# EAGLE design display (EAGLE 7.5.0)

## Sheet 1 of 5
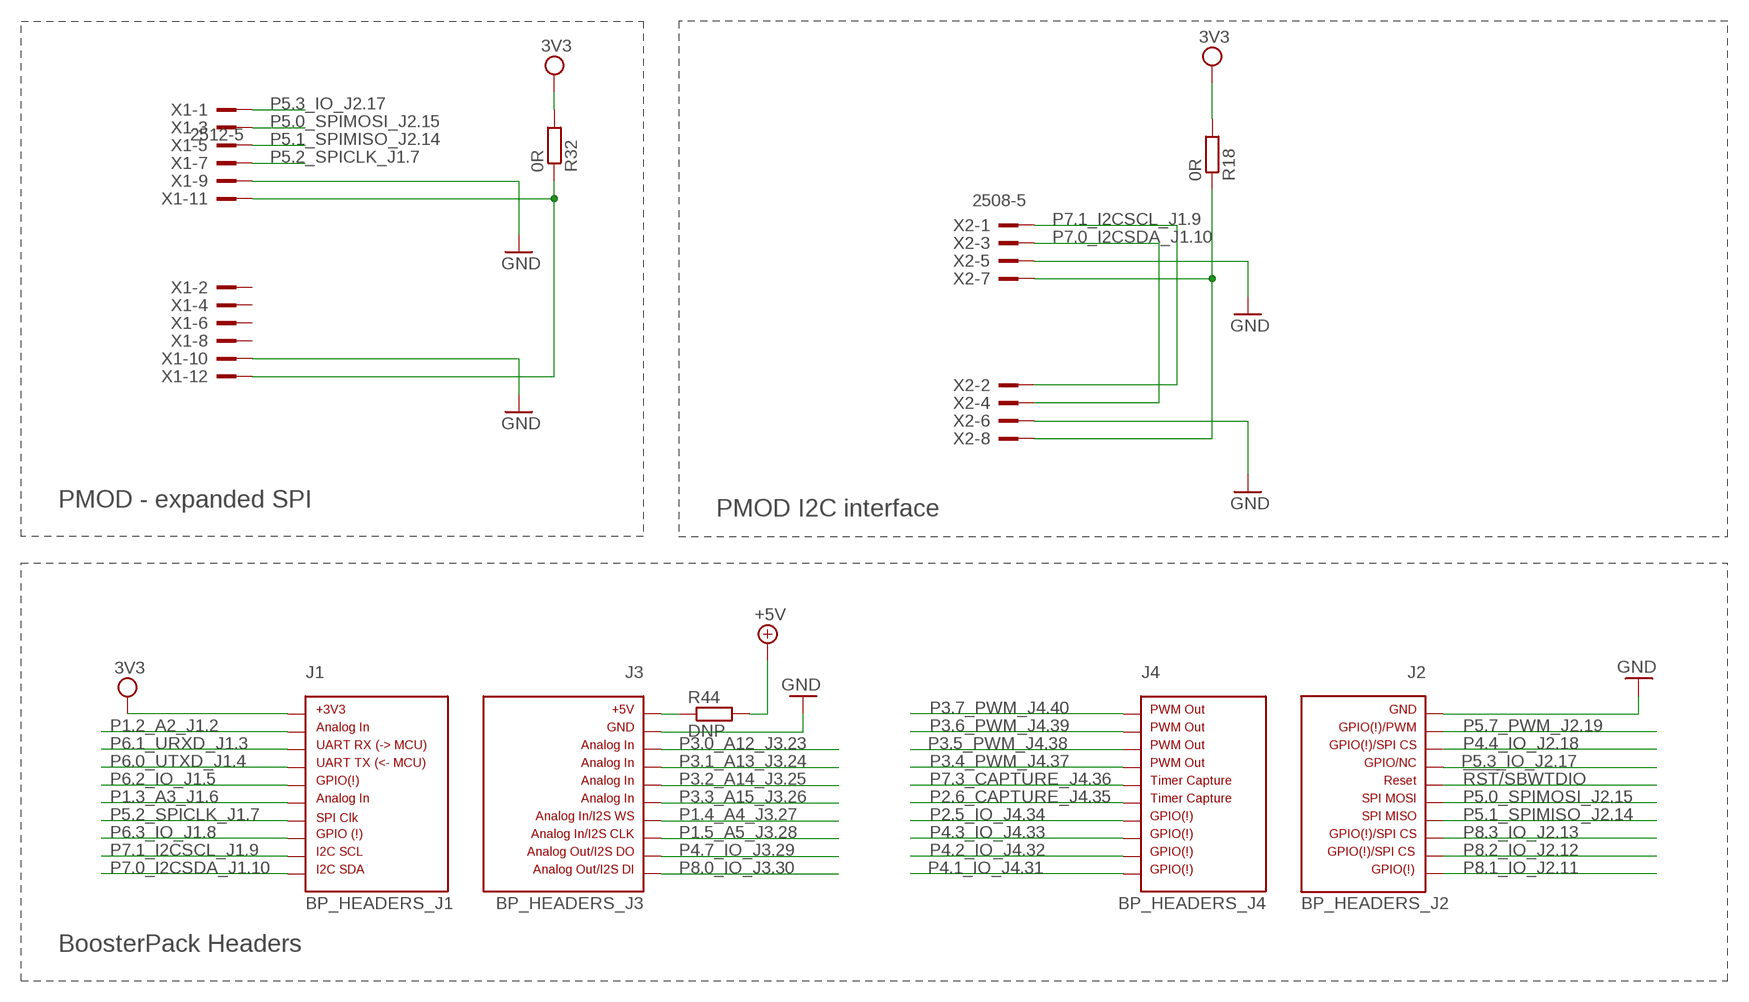
[diagram p0: schematic, sheet 1]

### Parts
J1  BP_HEADERS_J1  [J1]
J2  BP_HEADERS_J2  [J2]
J3  BP_HEADERS_J3  [J3]
J4  BP_HEADERS_J4  [J4]
R18  0R  R-EU_0204/2V  [0204V]
R32  0R  R-EU_0204/2V  [0204V]
R44  DNP  R-EU_R0805W  [R0805W]
X1  2512-5  [PAK100/2500-5-12]
X2  2508-5  [PAK100/2500-5-08]

### Nets
3V3: J1.1 R18.2 R32.2 ; also sheet 2,3,4,5
!RST!/SBWTDIO: J2.16
+5V: R44.2 ; also sheet 2,4
GND: J2.20 J3.22 X1.9 X1.10 X2.5 X2.6 ; also sheet 2,3,4,5
N$25: R18.1 X2.7 X2.8
N$38: R32.1 X1.11 X1.12
N$41: J3.21 R44.1
P1.2_A2_J1.2: J1.2 ; also sheet 2
P1.3_A3_J1.6: J1.6 ; also sheet 2
P1.4_A4_J3.27: J3.27 ; also sheet 3
P1.5_A5_J3.28: J3.28 ; also sheet 3
P2.5_IO_J4.34: J4.34 ; also sheet 3
P2.6_CAPTURE_J4.35: J4.35 ; also sheet 3
P3.0_A12_J3.23: J3.23 ; also sheet 2
P3.1_A13_J3.24: J3.24 ; also sheet 2
P3.2_A14_J3.25: J3.25 ; also sheet 2
P3.3_A15_J3.26: J3.26 ; also sheet 3
P3.4_PWM_J4.37: J4.37
P3.5_PWM_J4.38: J4.38
P3.6_PWM_J4.39: J4.39
P3.7_PWM_J4.40: J4.40
P4.1_IO_J4.31: J4.31
P4.2_IO_J4.32: J4.32
P4.3_IO_J4.33: J4.33
P4.4_IO_J2.18: J2.18 ; also sheet 4
P4.7_IO_J3.29: J3.29
P5.0_SPIMOSI_J2.15: J2.15 X1.3 ; also sheet 3,4
P5.1_SPIMISO_J2.14: J2.14 X1.5 ; also sheet 3
P5.2_SPICLK_J1.7: J1.7 X1.7 ; also sheet 3,4
P5.3_IO_J2.17: J2.17 X1.1
P5.7_PWM_J2.19: J2.19 ; also sheet 5
P6.0_UTXD_J1.4: J1.4
P6.1_URXD_J1.3: J1.3
P6.2_IO_J1.5: J1.5
P6.3_IO_J1.8: J1.8 ; also sheet 5
P7.0_I2CSDA_J1.10: J1.10 X2.3 X2.4 ; also sheet 3,4
P7.1_I2CSCL_J1.9: J1.9 X2.1 X2.2 ; also sheet 3,4
P7.3_CAPTURE_J4.36: J4.36 ; also sheet 4
P8.0_IO_J3.30: J3.30
P8.1_IO_J2.11: J2.11 ; also sheet 5
P8.2_IO_J2.12: J2.12 ; also sheet 5
P8.3_IO_J2.13: J2.13 ; also sheet 4
Unconnected: X1.2 X1.4 X1.6 X1.8

### Notes on the sheet
- PMOD - expanded SPI
- PMOD I2C interface
- BoosterPack Headers

## Sheet 2 of 5
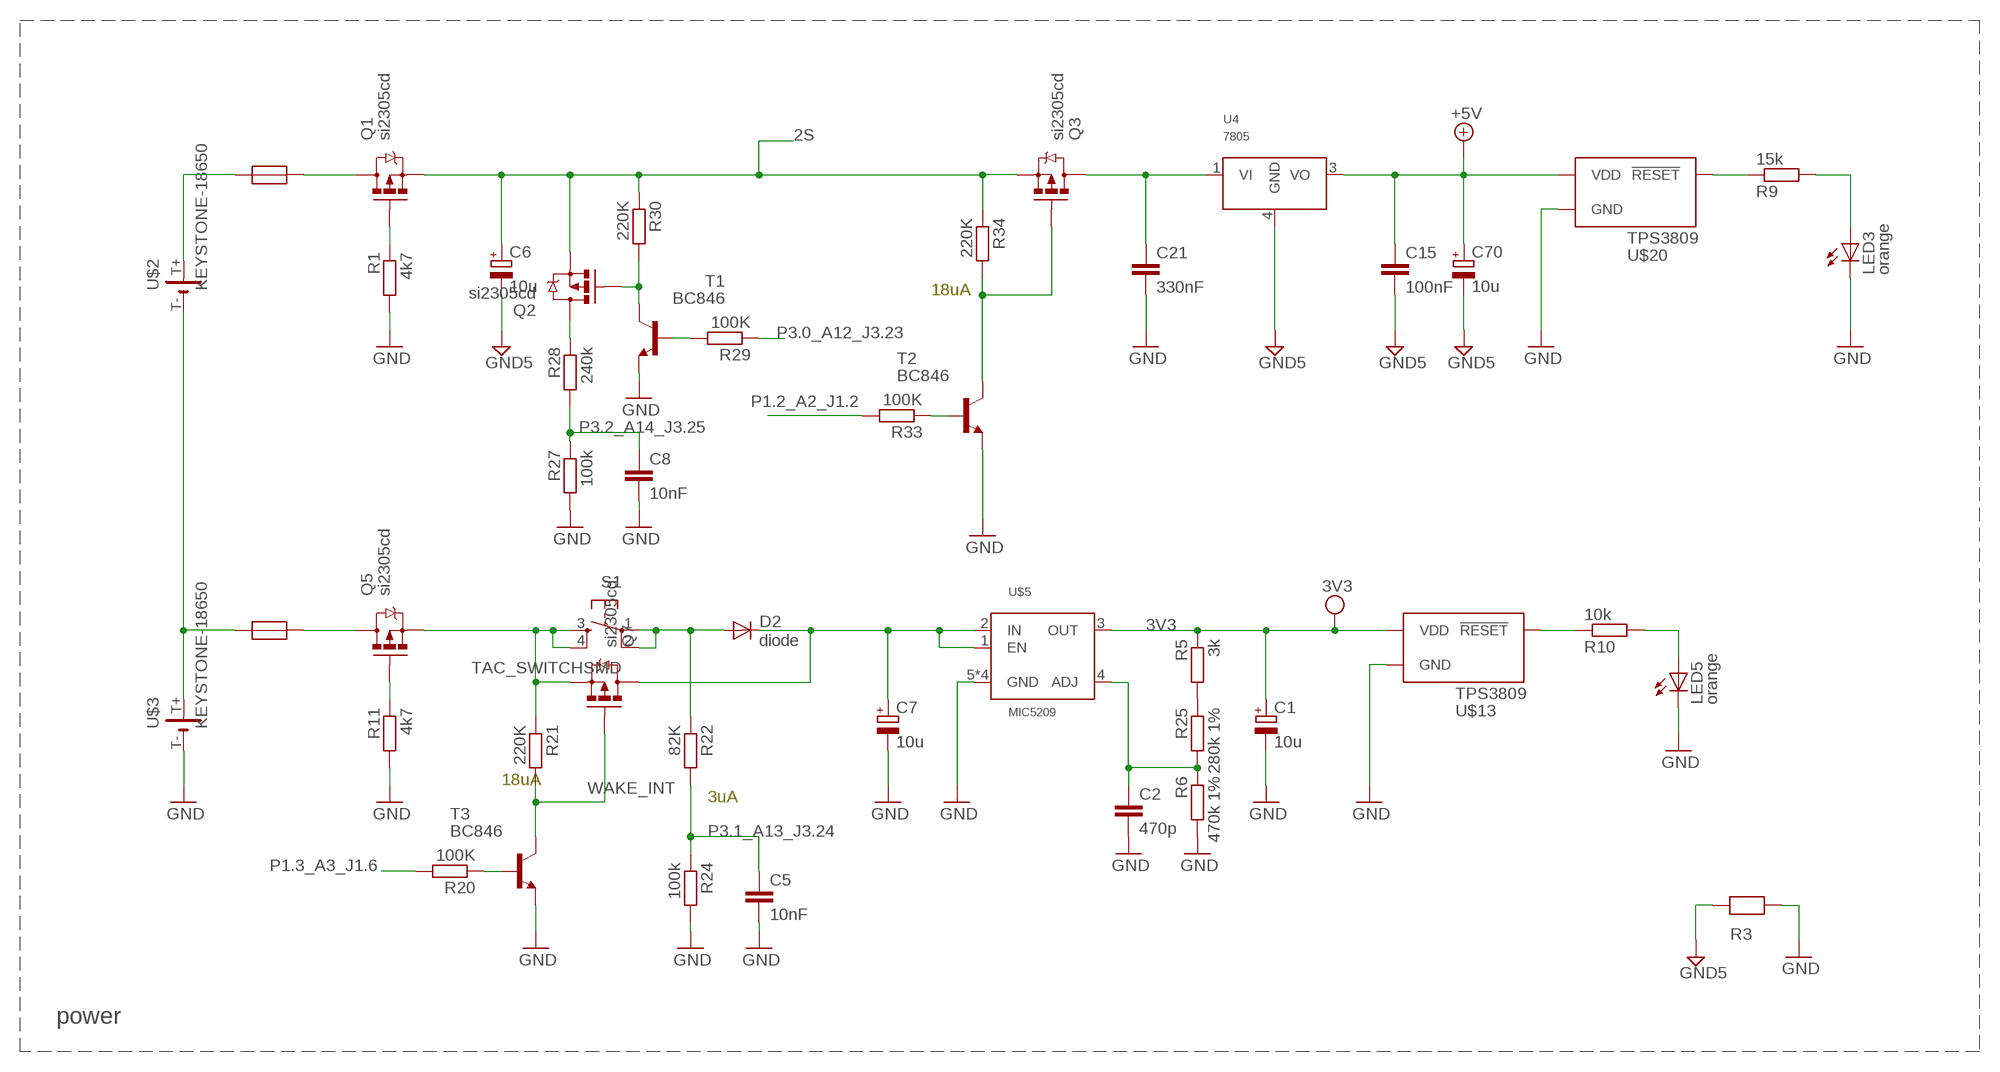
[diagram p1: schematic, sheet 2]

### Parts
C1  10u  CPOL-EU153CLV-0405  [153CLV-0405]
C2  470p  C-EUC0805  [C0805]
C5  10nF  C-EUC0805  [C0805]
C6  10u  CPOL-EU153CLV-0405  [153CLV-0405]
C7  10u  CPOL-EU153CLV-0405  [153CLV-0405]
C8  10nF  C-EUC0805  [C0805]
C15  100nF  C-EUC0805  [C0805]
C21  330nF  C-EUC0805  [C0805]
C70  10u  CPOL-EU153CLV-0405  [153CLV-0405]
D2  diode  DIODESMA  [SMA-DIODE]
LED3  orange  LEDCHIPLED_0805  [CHIPLED_0805]
LED5  orange  LEDCHIPLED_0805  [CHIPLED_0805]
Q1  si2305cd  MOSFET-PCHANNELSMD_POWER  [SOT23-3_POWER]
Q2  si2305cd  MOSFET-PCHANNELSMD_POWER  [SOT23-3_POWER]
Q3  si2305cd  MOSFET-PCHANNELSMD_POWER  [SOT23-3_POWER]
Q5  si2305cd  MOSFET-PCHANNELSMD_POWER  [SOT23-3_POWER]
Q7  si2305cd  MOSFET-PCHANNELSMD_POWER  [SOT23-3_POWER]
R1  4k7  R-EU_R0805W  [R0805W]
R3  0R_0805  [R0805W]
R5  3k  R-EU_R0805W  [R0805W]
R6  470k 1%  R-EU_R0805W  [R0805W]
R9  15k  R-EU_R0805W  [R0805W]
R10  10k  R-EU_R0805W  [R0805W]
R11  4k7  R-EU_R0805W  [R0805W]
R20  100K  R-EU_R0805W  [R0805W]
R21  220K  R-EU_R0805W  [R0805W]
R22  82K  R-EU_R0805W  [R0805W]
R24  100k  R-EU_R0805W  [R0805W]
R25  280k 1%  R-EU_R0805W  [R0805W]
R27  100k  R-EU_R0805W  [R0805W]
R28  240k  R-EU_R0805W  [R0805W]
R29  100K  R-EU_R0805W  [R0805W]
R30  220K  R-EU_R0805W  [R0805W]
R33  100K  R-EU_R0805W  [R0805W]
R34  220K  R-EU_R0805W  [R0805W]
S1  TAC_SWITCHSMD  [TACTILE-SWITCH-SMD]
T1  BC846  [SOT23]
T2  BC846  [SOT23]
T3  BC846  [SOT23]
U4  7805  78XX  [D2PACK]
U$2  KEYSTONE-18650  [KEYSTONE_COMBO_18650]
U$3  KEYSTONE-18650  [KEYSTONE_COMBO_18650]
U$5  MIC5209  [SO-08]
U$7  Fuse 1A  RESETTABLE_0805  [0805W]
U$8  Fuse 1A  RESETTABLE_0805  [0805W]
U$13  TPS3809  [R_PDSO_G3]
U$20  TPS3809  [R_PDSO_G3]

### Nets
2S: C6.+ Q1.2(S) Q2.2(S) Q3.2(S) R30.1 R34.1 ; also sheet 5
3V3: C1.+ R5.1 U$5.3(OUT) U$13.P$3(VDD) ; also sheet 1,3,4,5
+5V: C15.1 C70.+ U4.3(VO) U$20.P$3(VDD) ; also sheet 1,4
GND: C1.- C2.2 C5.2 C7.- C8.2 C21.2 LED3.C LED5.C R1.2 R3.2 R6.2 R11.2 R24.2 R27.2 T1.2(E) T2.2(E) T3.2(E) U$3.T-(-) U$5.5(GND) U$5.6(GND) U$5.7(GND) U$5.8(GND) U$13.P$1(GND) U$20.P$1(GND) ; also sheet 1,3,4,5
GND5: C6.- C15.2 C70.- R3.1 U4.4(GND) ; also sheet 4
N$1: C21.1 Q3.3(D) U4.1(VI)
N$2: Q1.1(G) R1.1
N$6: Q5.2(S) Q7.2(S) R21.1 S1.3 S1.4
N$7: LED3.A R9.2
N$9: C2.1 R6.1 R25.2 U$5.4(ADJ)
N$10: Q1.3(D) U$7.2
N$11: Q5.3(D) U$8.2
N$13: R9.1 U$20.P$2(!RESET)
N$14: LED5.A R10.2
N$15: R10.1 U$13.P$2(!RESET)
N$23: C7.+ D2.C Q7.3(D) U$5.1(EN) U$5.2(IN)
N$24: Q5.1(G) R11.1
N$26: R5.2 R25.1
N$29: Q2.3(D) R28.1
N$30: Q2.1(G) R30.2 T1.3(C)
N$31: R20.1 T3.1(B)
N$32: R29.2 T1.1(B)
N$35: R33.1 T2.1(B)
N$37: Q3.1(G) R34.2 T2.3(C)
N_BAT1: U$2.T-(-) U$3.T+(+) U$8.1
N_BAT2: U$2.T+(+) U$7.1
P1.2_A2_J1.2: R33.2 ; also sheet 1
P1.3_A3_J1.6: R20.2 ; also sheet 1
P3.0_A12_J3.23: R29.1 ; also sheet 1
P3.1_A13_J3.24: C5.1 R22.2 R24.1 ; also sheet 1
P3.2_A14_J3.25: C8.1 R27.1 R28.2 ; also sheet 1
PUSH: D2.A R22.1 S1.1 S1.2
WAKE_INT: Q7.1(G) R21.2 T3.3(C) ; also sheet 4

### Notes on the sheet
- 18uA
- 18uA
- 3uA
- power

## Sheet 3 of 5
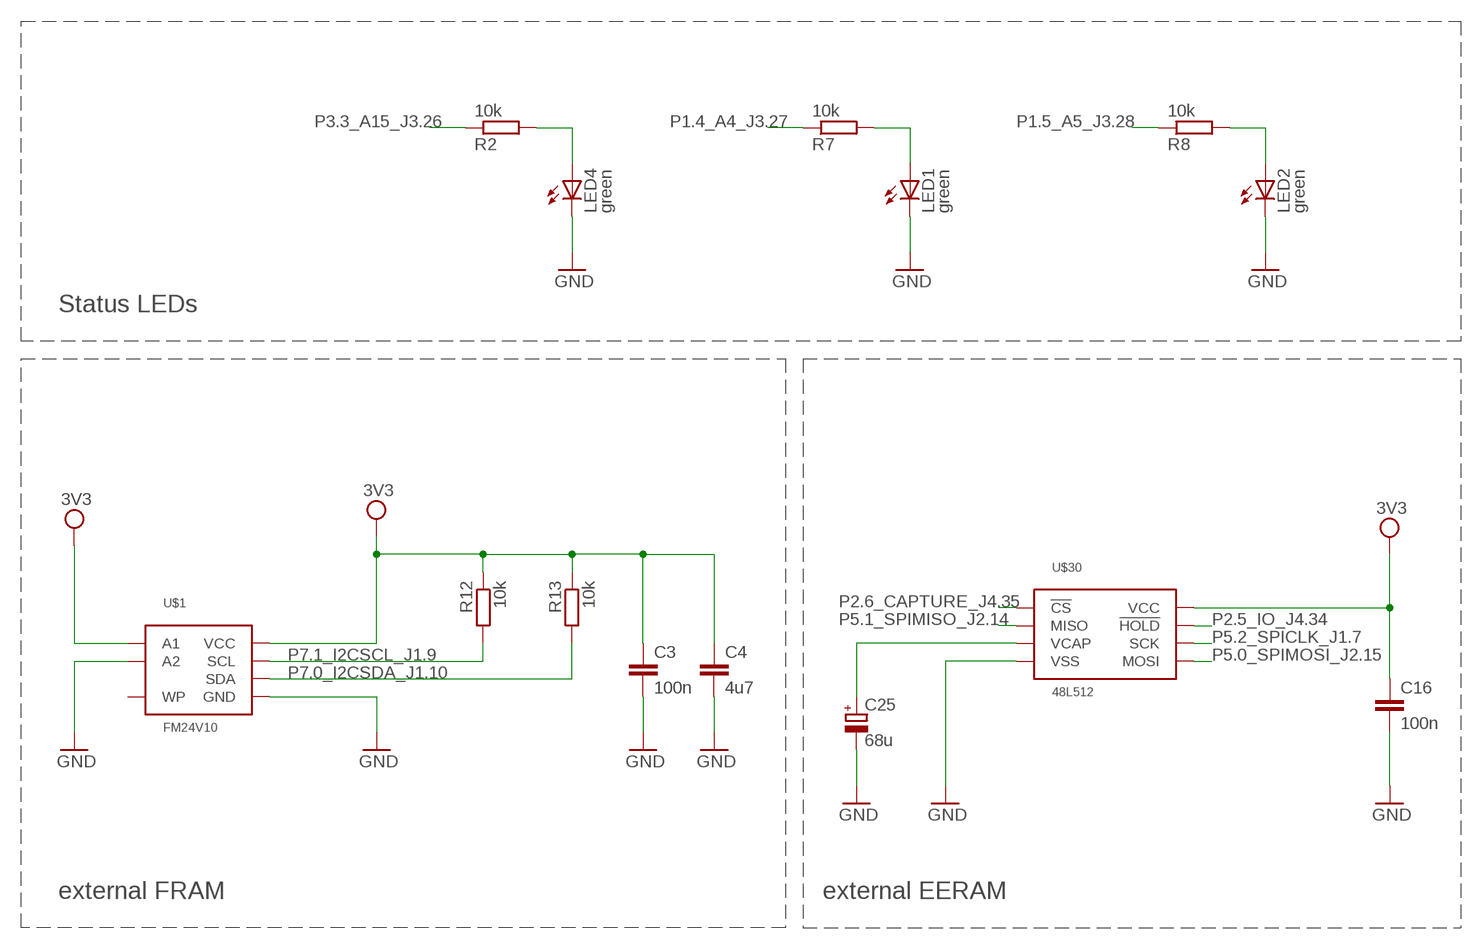
[diagram p2: schematic, sheet 3]

### Parts
C3  100n  C-EUC0805  [C0805]
C4  4u7  C-EUC0805  [C0805]
C16  100n  C-EUC0805  [C0805]
C25  68u  CPOL-EUSANYO_SMD_C6  [SANYO-OSCON_SMD_C6]
LED1  green  LEDCHIPLED_0805  [CHIPLED_0805]
LED2  green  LEDCHIPLED_0805  [CHIPLED_0805]
LED4  green  LEDCHIPLED_0805  [CHIPLED_0805]
R2  10k  R-EU_R0805W  [R0805W]
R7  10k  R-EU_R0805W  [R0805W]
R8  10k  R-EU_R0805W  [R0805W]
R12  10k  R-EU_R0805W  [R0805W]
R13  10k  R-EU_R0805W  [R0805W]
U$1  FM24V10  FM24V  [SO-08]
U$30  48L512  48LXXX  [SO-08]

### Nets
3V3: C3.1 C4.1 C16.1 R12.1 R13.1 U$1.2(A1) U$1.8(VCC) U$30.8(VCC) ; also sheet 1,2,4,5
GND: C3.2 C4.2 C16.2 C25.- LED1.C LED2.C LED4.C U$1.3(A2) U$1.4(GND) U$30.4(VSS) ; also sheet 1,2,4,5
N$5: LED4.A R2.2
N$8: LED1.A R7.2
N$12: LED2.A R8.2
N$40: C25.+ U$30.3(VCAP)
P1.4_A4_J3.27: R7.1 ; also sheet 1
P1.5_A5_J3.28: R8.1 ; also sheet 1
P2.5_IO_J4.34: U$30.7(!HOLD) ; also sheet 1
P2.6_CAPTURE_J4.35: U$30.1(!CS) ; also sheet 1
P3.3_A15_J3.26: R2.1 ; also sheet 1
P5.0_SPIMOSI_J2.15: U$30.5(MOSI) ; also sheet 1,4
P5.1_SPIMISO_J2.14: U$30.2(MISO) ; also sheet 1
P5.2_SPICLK_J1.7: U$30.6(SCK) ; also sheet 1,4
P7.0_I2CSDA_J1.10: R13.2 U$1.5(SDA) ; also sheet 1,4
P7.1_I2CSCL_J1.9: R12.2 U$1.6(SCL) ; also sheet 1,4
Unconnected: U$1.7(WP)

### Notes on the sheet
- Status LEDs
- external FRAM | external EERAM

## Sheet 4 of 5
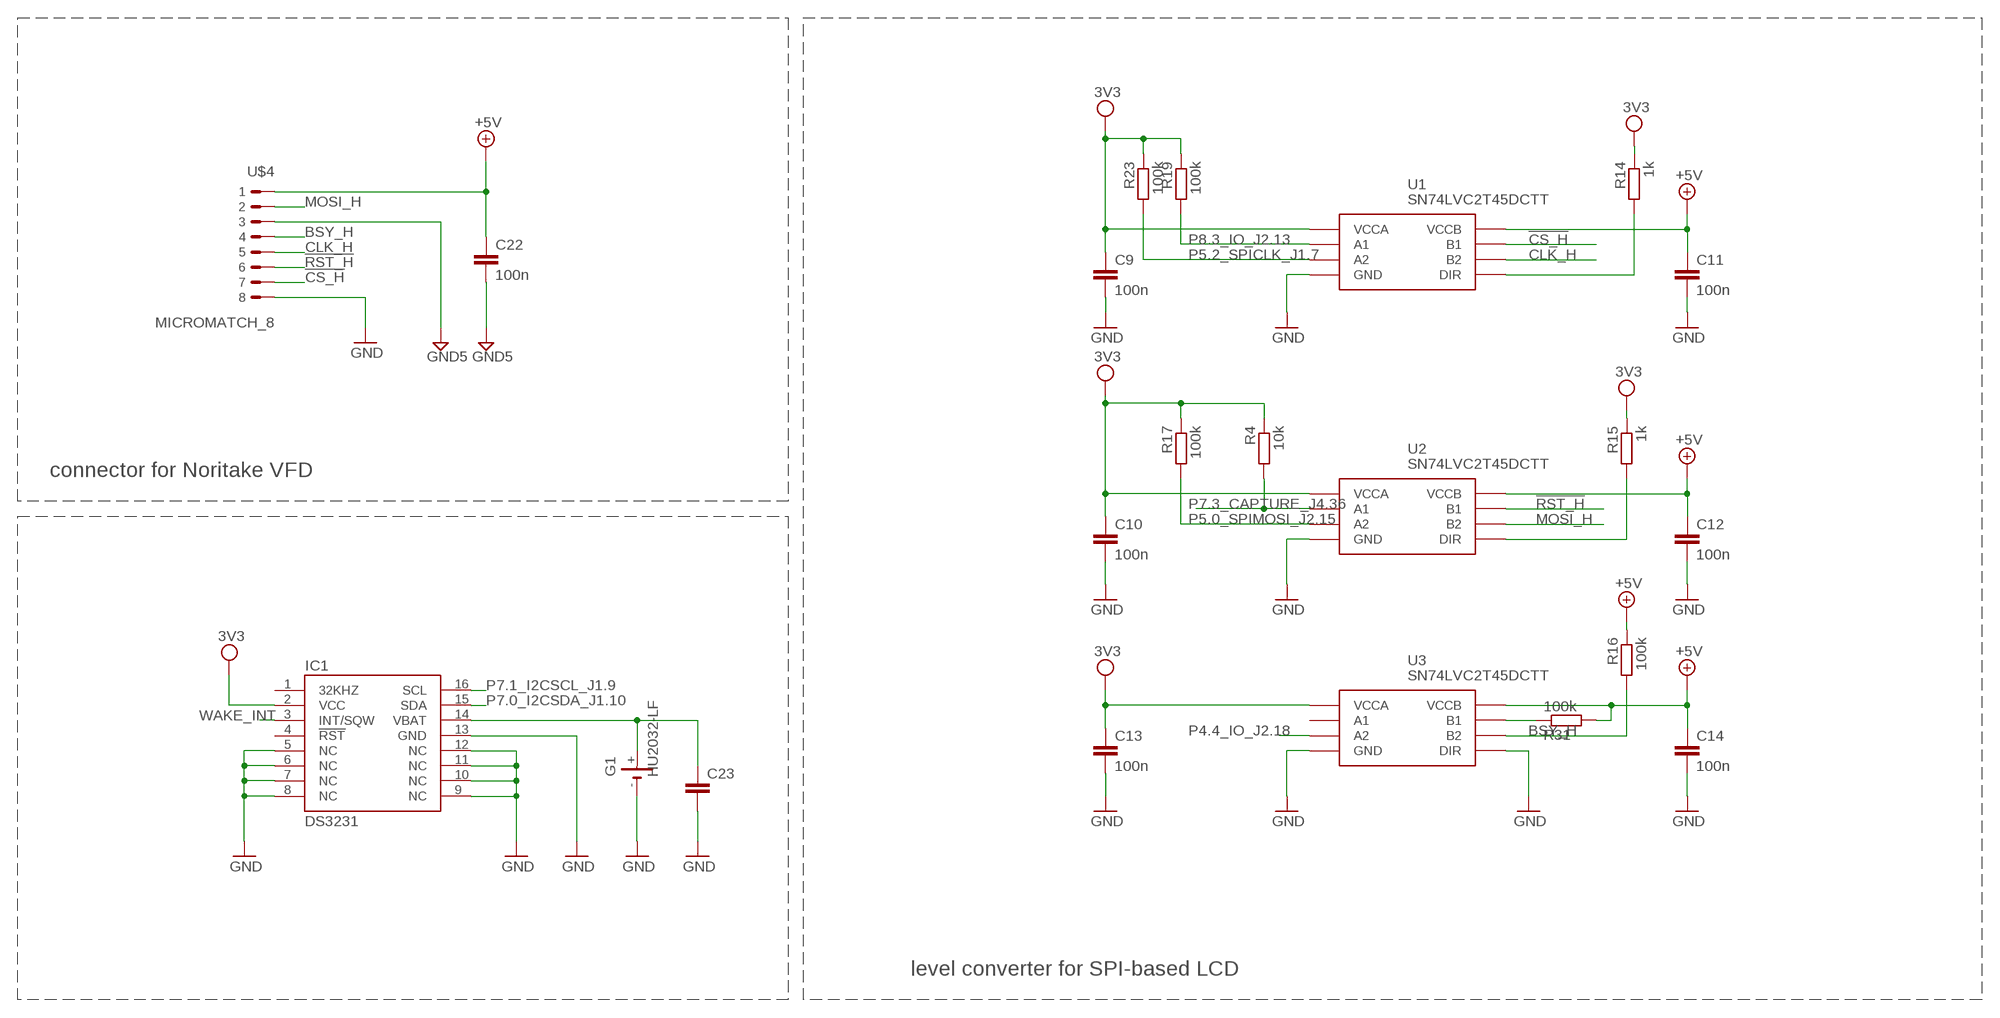
[diagram p3: schematic, sheet 4]

### Parts
C9  100n  C-EUC0805  [C0805]
C10  100n  C-EUC0805  [C0805]
C11  100n  C-EUC0805  [C0805]
C12  100n  C-EUC0805  [C0805]
C13  100n  C-EUC0805  [C0805]
C14  100n  C-EUC0805  [C0805]
C22  100n  C-EUC0805  [C0805]
C23  C-EU102-054X133  [C102-054X133]
G1  HU2032-LF  [HU2032-LF]
IC1  DS3231  [SO-16]
R4  10k  R-EU_R0805W  [R0805W]
R14  1k  R-EU_R0805W  [R0805W]
R15  1k  R-EU_R0805W  [R0805W]
R16  100k  R-EU_R0805W  [R0805W]
R17  100k  R-EU_R0805W  [R0805W]
R19  100k  R-EU_R0805W  [R0805W]
R23  100k  R-EU_R0805W  [R0805W]
R31  100k  R-EU_R0805W  [R0805W]
U1  SN74LVC2T45DCTT  [SSOP8]
U2  SN74LVC2T45DCTT  [SSOP8]
U3  SN74LVC2T45DCTT  [SSOP8]
U$4  MICROMATCH_8  [MICROMATCH8]

### Nets
3V3: C9.1 C10.1 C13.1 IC1.2(VCC) R4.1 R14.1 R15.1 R17.1 R19.1 R23.1 U1.P$1(VCCA) U2.P$1(VCCA) U3.P$1(VCCA) ; also sheet 1,2,3,5
!CS_H: U1.P$7(B1) U$4.P$7
!RST_H: U2.P$7(B1) U$4.P$6
+5V: C11.1 C12.1 C14.1 C22.1 R16.1 R31.2 U1.P$8(VCCB) U2.P$8(VCCB) U3.P$8(VCCB) U$4.P$1 ; also sheet 1,2
BSY_H: R16.2 U3.P$6(B2) U$4.P$4
CLK_H: U1.P$6(B2) U$4.P$5
GND: C9.2 C10.2 C11.2 C12.2 C13.2 C14.2 C23.2 G1.- IC1.5(NC) IC1.6(NC) IC1.7(NC) IC1.8(NC) IC1.9(NC) IC1.10(NC) IC1.11(NC) IC1.12(NC) IC1.13(GND) U1.P$4(GND) U2.P$4(GND) U3.P$4(GND) U3.P$5(DIR) U$4.P$8 ; also sheet 1,2,3,5
GND5: C22.2 U$4.P$3 ; also sheet 2
MOSI_H: U2.P$6(B2) U$4.P$2
N$4: R14.2 U1.P$5(DIR)
N$17: R15.2 U2.P$5(DIR)
N$20: R31.1 U3.P$7(B1)
N$27: C23.1 G1.+ IC1.14(VBAT)
P4.4_IO_J2.18: U3.P$3(A2) ; also sheet 1
P5.0_SPIMOSI_J2.15: R17.2 U2.P$3(A2) ; also sheet 1,3
P5.2_SPICLK_J1.7: R23.2 U1.P$3(A2) ; also sheet 1,3
P7.0_I2CSDA_J1.10: IC1.15(SDA) ; also sheet 1,3
P7.1_I2CSCL_J1.9: IC1.16(SCL) ; also sheet 1,3
P7.3_CAPTURE_J4.36: R4.2 U2.P$2(A1) ; also sheet 1
P8.3_IO_J2.13: R19.2 U1.P$2(A1) ; also sheet 1
WAKE_INT: IC1.3(INT/SQW) ; also sheet 2
Unconnected: G1.+@1(+) IC1.1(32KHZ) IC1.4(!RST) U3.P$2(A1)

### Notes on the sheet
- connector for Noritake VFD
- level converter for SPI-based LCD

## Sheet 5 of 5
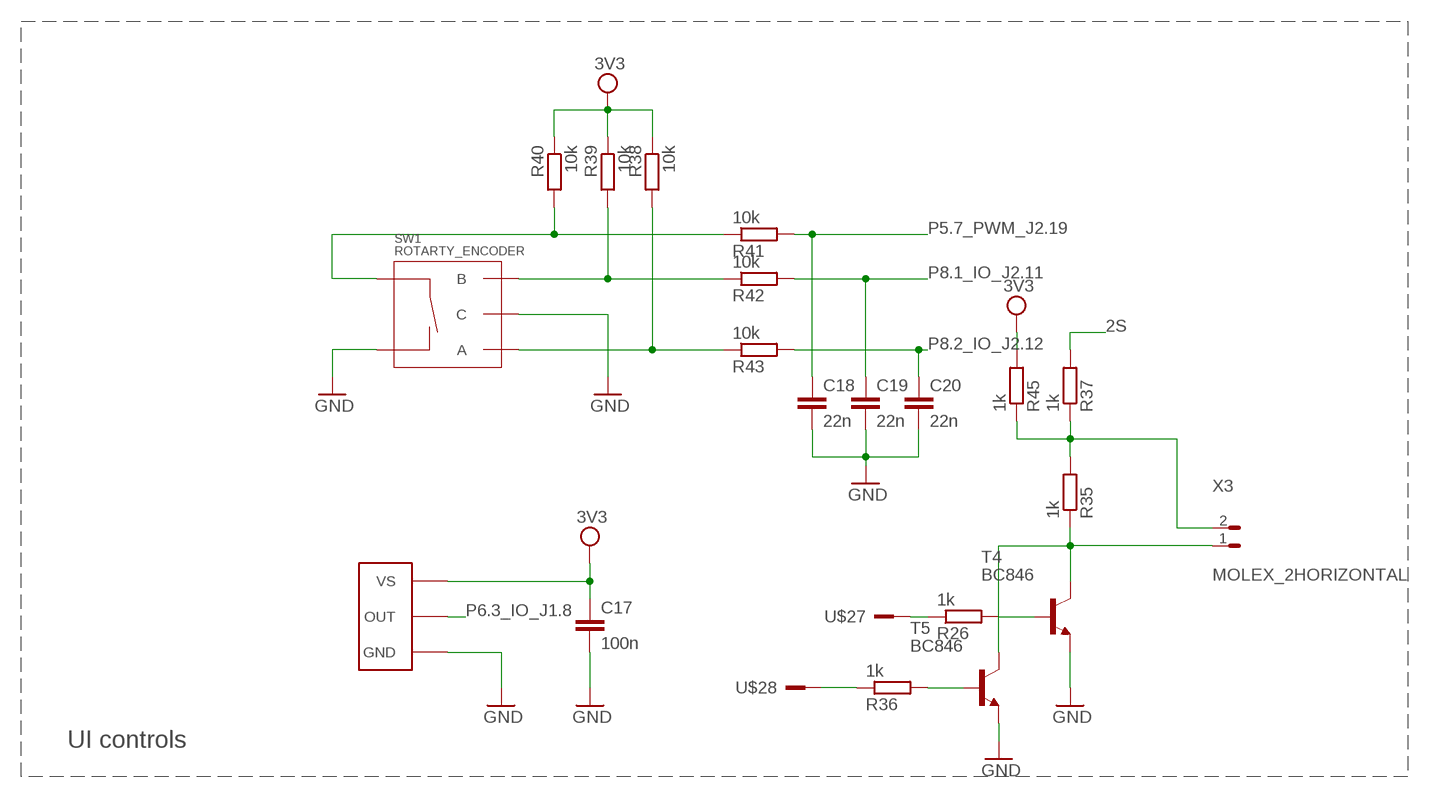
[diagram p4: schematic, sheet 5]

### Parts
C17  100n  C-EUC0805  [C0805]
C18  22n  C-EUC0805  [C0805]
C19  22n  C-EUC0805  [C0805]
C20  22n  C-EUC0805  [C0805]
R26  1k  R-EU_R0805W  [R0805W]
R35  1k  R-EU_R0805W  [R0805W]
R36  1k  R-EU_R0805W  [R0805W]
R37  1k  R-EU_R0805W  [R0805W]
R38  10k  R-EU_R0805W  [R0805W]
R39  10k  R-EU_R0805W  [R0805W]
R40  10k  R-EU_R0805W  [R0805W]
R41  10k  R-EU_R0805W  [R0805W]
R42  10k  R-EU_R0805W  [R0805W]
R43  10k  R-EU_R0805W  [R0805W]
R45  1k  R-EU_R0805W  [R0805W]
SW1  ROTARTY_ENCODER  [ROTARY_ENC_PLAIN]
T4  BC846  [SOT23]
T5  BC846  [SOT23]
U$26  TSOP36X  [TSOP36X_SMD]
U$27  TP  [TP_THT]
U$28  TP  [TP_THT]
X3  MOLEX_2HORIZONTAL  [0530480210]

### Nets
2S: R37.2 ; also sheet 2
3V3: C17.1 R38.1 R39.1 R40.1 R45.2 U$26.P$3(VS) ; also sheet 1,2,3,4
GND: C17.2 C18.2 C19.2 C20.2 SW1.C SW1.SW- T4.2(E) T5.2(E) U$26.P$1(GND) ; also sheet 1,2,3,4
N$3: R35.2 R37.1 R45.1 X3.2
N$16: R26.2 T4.1(B)
N$21: R35.1 T4.3(C) T5.3(C) X3.1
N$22: R26.1 U$27.1(KL)
N$28: R40.2 R41.1 SW1.SW+
N$33: R39.2 R42.1 SW1.B
N$34: R38.2 R43.1 SW1.A
N$36: R36.2 T5.1(B)
N$39: R36.1 U$28.1(KL)
P5.7_PWM_J2.19: C18.1 R41.2 ; also sheet 1
P6.3_IO_J1.8: U$26.P$4(OUT) ; also sheet 1
P8.1_IO_J2.11: C19.1 R42.2 ; also sheet 1
P8.2_IO_J2.12: C20.1 R43.2 ; also sheet 1

### Notes on the sheet
- UI controls

## Library data of the parts
C1 C6 C7 C25 C70 = rcl:CPOL-EU: POLARIZED CAPACITOR, European symbol
C2-C5 C8-C23 = rcl:C-EU: CAPACITOR, European symbol
D2 = SparkFun-DiscreteSemi:DIODE: Diode These are standard reverse protection diodes and small signal diodes. SMA package can handle up to about 1A. SOD-323 can handle about 200mA. What the SOD-323 package when ordering, there are some mfgs out there that are 5-pin packages.
G1 = Simplex-Battery:HU2032-LF: Renata HU2032 Li battery holder
IC1 = Simplex-ICs:DS3231: DS3231 RTC
J1 = LaunchPad_Template_Library:BP_HEADERS_J1
J2 = LaunchPad_Template_Library:BP_HEADERS_J2
J3 = LaunchPad_Template_Library:BP_HEADERS_J3
J4 = LaunchPad_Template_Library:BP_HEADERS_J4
LED1-LED5 = led:LED: LED OSRAM: - CHIPLED LG R971, LG N971, LY N971, LG Q971, LY Q971, LO R971, LY R971 LH N974, LH R974 LS Q976, LO Q976, LY Q976 LO Q996 - Hyper CHIPLED LW Q18S LB Q993, LB Q99A, LB R99A - SideLED LS A670, LO A670, LY A670, LG A670, LP A670 LB A673, LV A673, LT A673, LW A673 LH A674 LY A675 LS A676, LA A676, LO A676, LY A676, LW A676 LS A679, LY A679, LG A679 - Hyper Micro SIDELED® LS Y876, LA Y876, LO Y876, LY Y876 LT Y87S - SmartLED LW L88C, LW L88S LB L89C, LB L89S, LG L890 LS L89K, LO L89K, LY L89K LS L896, LA L896, LO L896, LY L896 - TOPLED LS T670, LO T670, LY T670, LG T670, LP T670 LSG T670, LSP T670, LSY T670, LOP T670, LYG T670 LG T671, LOG T671, LSG T671 LB T673, LV T673, LT T673, LW T673 LH T674 LS T676, LA T676, LO T676, LY T676, LB T676, LH T676, LSB T676, LW T676 LB T67C, LV T67C, LT T67C, LS T67K, LO T67K, LY T67K, LW E67C LS E67B, LA E67B, LO E67B, LY E67B, LB E67C, LV E67C, LT E67C LW T67C LS T679, LY T679, LG T679 LS T770, LO T770, LY T770, LG T770, LP T770 LB T773, LV T773, LT T773, LW T773 LH T774 LS E675, LA E675, LY E675, LS T675 LS T776, LA T776, LO T776, LY T776, LB T776 LHGB T686 LT T68C, LB T68C - Hyper Mini TOPLED® LB M676 - Mini TOPLED Santana® LG M470 LS M47K, LO M47K, LY M47K Source: http://www.osram.convergy.de LUXEON: - LUMILED® LXK2-PW12-R00, LXK2-PW12-S00, LXK2-PW14-U00, LXK2-PW14-V00 LXK2-PM12-R00, LXK2-PM12-S00, LXK2-PM14-U00 LXK2-PE12-Q00, LXK2-PE12-R00, LXK2-PE12-S00, LXK2-PE14-T00, LXK2-PE14-U00 LXK2-PB12-K00, LXK2-PB12-L00, LXK2-PB12-M00, LXK2-PB14-N00, LXK2-PB14-P00, LXK2-PB14-Q00 LXK2-PR12-L00, LXK2-PR12-M00, LXK2-PR14-Q00, LXK2-PR14-R00 LXK2-PD12-Q00, LXK2-PD12-R00, LXK2-PD12-S00 LXK2-PH12-R00, LXK2-PH12-S00 LXK2-PL12-P00, LXK2-PL12-Q00, LXK2-PL12-R00 Source: www.luxeon.com KINGBRIGHT: KA-3528ASYC Source: www.kingbright.com
Q1-Q3 Q5 Q7 = Simplex-DiscreteSemi:MOSFET-PCHANNEL: Generic PMOSFET
R1 R2 R4-R45 = rcl:R-EU_: RESISTOR, European symbol
R3 = Simplex-Jumpers:0R
S1 = SparkFun-Electromechanical:TAC_SWITCH: Momentary Switch Button commonly used for reset or general input. Spark Fun Electronics SKU : COM-00097 SMT- SWCH-08247; PROD_ID: SWCH-08247
SW1 = SparkFun-Electromechanical:ROTARTY_ENCODER: Simple no LED rotary encoder Example: COM-09117
T1-T5 = transistor:BC846: NPN TRANSISTOR
U1-U3 = Simplex-ICs:SN74LVC2T45: SN74LVC2T45
U4 = Simplex-ICs:78XX: 78xx positive voltage linear regulators
U$1 = Simplex-ICs:FM24V: CYPRESS FM24Vxx serial f-ram
U$2 U$3 = Simplex-Battery:KEYSTONE-18650
U$4 = Simplex-Connectors:MICROMATCH_8: MicroMatch 215079-8
U$5 = Simplex-ICs:MIC5209: Micrel MIC5209
U$7 U$8 = Simplex-Fuses:RESETTABLE: resettable fuse
U$13 U$20 = Simplex-ICs:TPS3809: Texas Instruments TPS3809
U$26 = Simplex-ICs:TSOP36X: TSOP36x infrared receiver
U$27 U$28 = Simplex-Connectors:TP: test point
U$30 = Simplex-ICs:48LXXX: 48Lxxx series Microchip SPI serial EERAM
X1 = Simplex-Connectors:2512-: 3M (TM) Pak 100 4-Wall Header Source: 3M; MPN: N2514-5002RB; OC_FARNELL: 1788673; OC_NEWARK: 97K6709
X2 = Simplex-Connectors:2508-: 3M (TM) Pak 100 4-Wall Header Source: 3M; OC_FARNELL: 1788669; OC_NEWARK: unknown
X3 = Simplex-Connectors:MOLEX_2: Molex 2 pin connectors 1.25mm PicoBlade

## Net classes
1 vcc: width 0.203 mm

## Board
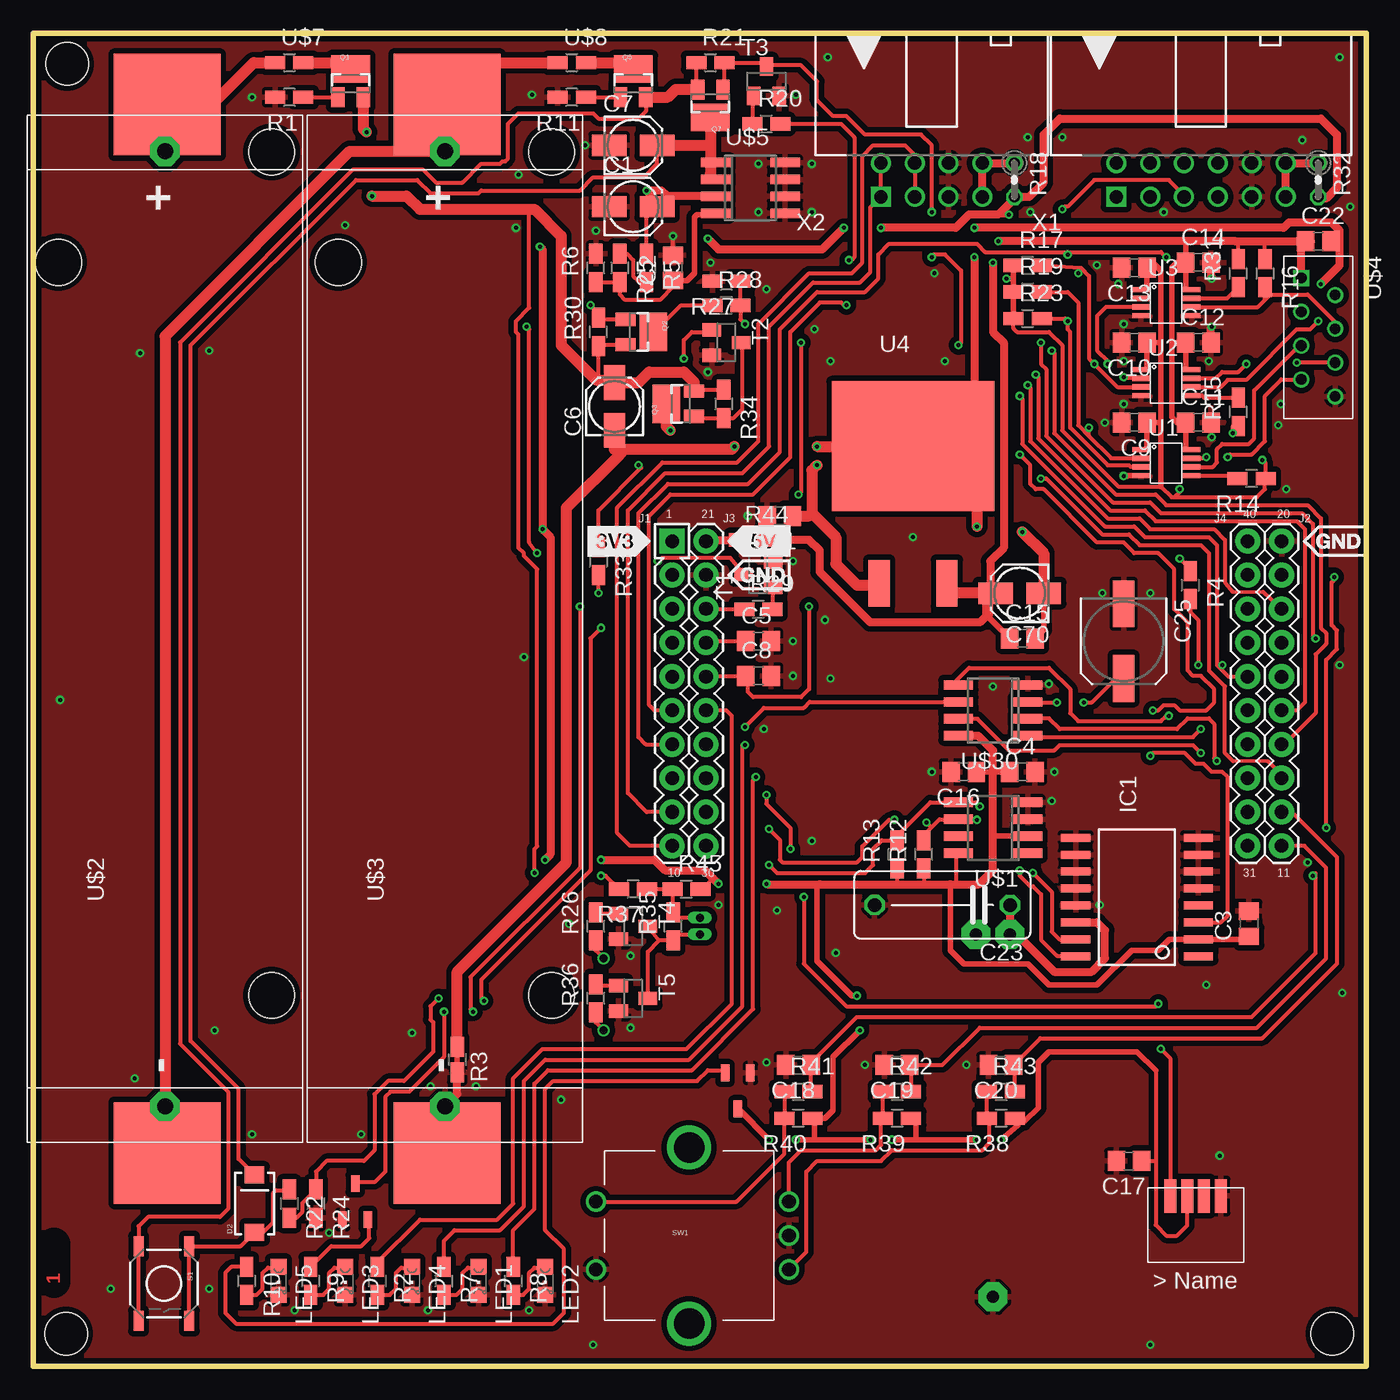
[diagram p5: board, top side]
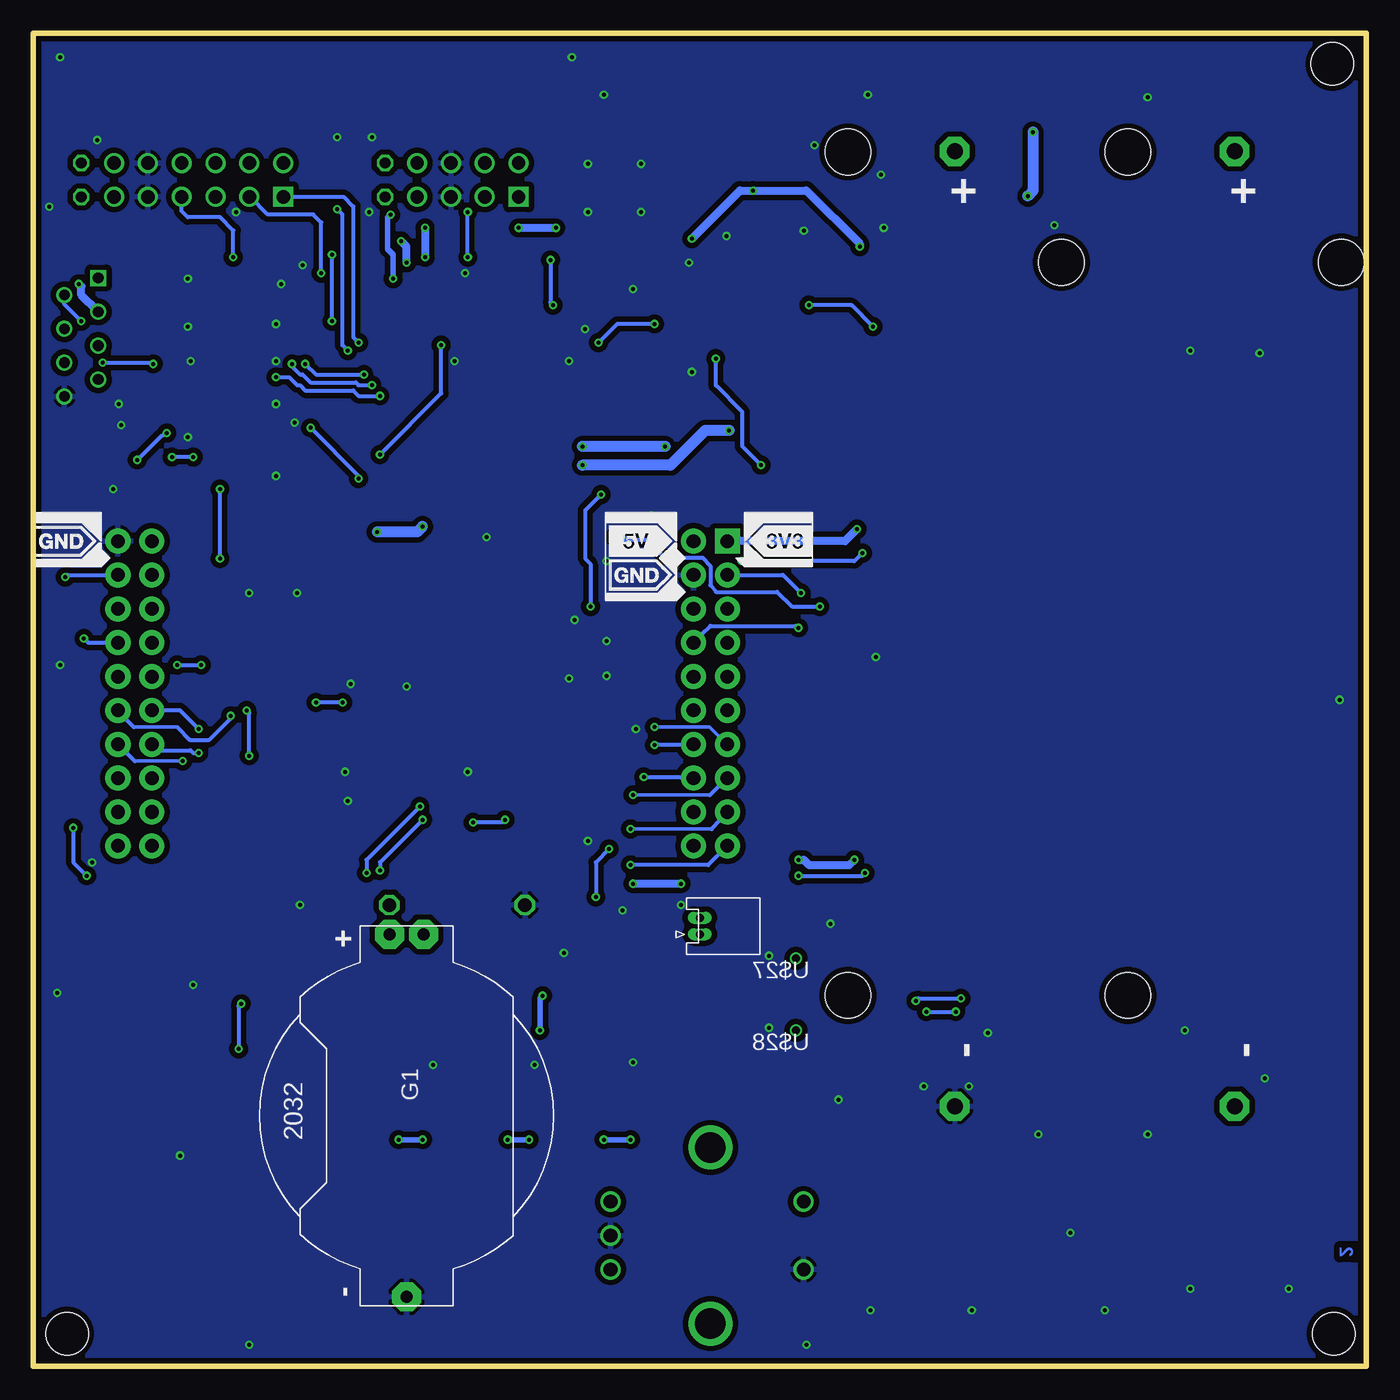
[diagram p6: board, bottom side, seen from below]

Size 100 x 100 mm. Coordinates in mm from the lower left corner, seen from the top.
Outline: 0,0 100,0 100,100 0,100 0,0
Copper layers (1*16): Top 0.035mm / dielectric 1.5mm / Bottom 0.035mm
Design rules "seeed_2-layer_20140221": minimum track width 6mil, minimum drill 12mil, track to track 6mil, track to pad 6mil, pad to pad 6mil, via to via 6mil, smd to smd 0mil, copper to edge 10mil, drill to drill 10mil, minimum pad ring 6mil, minimum via ring 6mil, stop-mask expansion 2mil, vias tented up to drill 100mil, thermal gap 10mil
Holes 3.2 mm at 2.45,2.45 2.54,97.71 97.46,2.45
tRestrict: 1 lines

### Footprints (pad centres in the part's own frame; a part is rotated, then mirrored left to right if it is on the bottom)
153CLV-0405 = smd 2.6 x 1.6: + 1.8,0; - -1.8,0
C0805 = smd 1.3 x 1.5: 1 -0.95,0; 2 0.95,0
C102-054X133 = drill 1.016 octagon: 1 -5.08,0; 2 5.08,0
SANYO-OSCON_SMD_C6 = smd 3.5 x 1.6: + 2.8,0; - -2.8,0
SMA-DIODE = smd 1.27 x 1.47: A -2.15,0; C 2.15,0
HU2032-LF = drill 0.9 pad 2.184 octagon: + -13.6,-1.27; +@1 -13.6,1.27; - 13.6,0
SO-16 = smd 0.6 x 2.2: 1 -4.445,-4.6; 2 -3.175,-4.6; 3 -1.905,-4.6; 4 -0.635,-4.6; 5 0.635,-4.6; 6 1.905,-4.6; 7 3.175,-4.6; 8 4.445,-4.6; 9 4.445,4.6; 10 3.175,4.6; 11 1.905,4.6; 12 0.635,4.6; 13 -0.635,4.6; 14 -1.905,4.6; 15 -3.175,4.6; 16 -4.445,4.6
J1 = drill 1.016 pad 1.88 square: 1 0,22.86 | drill 1.016 pad 1.88: 2 0,20.32; 3 0,17.78; 4 0,15.24; 5 0,12.7; 6 0,10.16; 7 0,7.62; 8 0,5.08; 9 0,2.54; 10 0,0
J2 = drill 1.016 pad 1.88: 11 0,0; 12 0,2.54; 13 0,5.08; 14 0,7.62; 15 0,10.16; 16 0,12.7; 17 0,15.24; 18 0,17.78; 19 0,20.32; 20 0,22.86
J3 = drill 1.016 pad 1.88: 21 0,22.86; 22 0,20.32; 23 0,17.78; 24 0,15.24; 25 0,12.7; 26 0,10.16; 27 0,7.62; 28 0,5.08; 29 0,2.54; 30 0,0
J4 = drill 1.016 pad 1.88: 31 0,0; 32 0,2.54; 33 0,5.08; 34 0,7.62; 35 0,10.16; 36 0,12.7; 37 0,15.24; 38 0,17.78; 39 0,20.32; 40 0,22.86
CHIPLED_0805 = smd 1.2 x 1.2: A 0,-1.05; C 0,1.05
SOT23-3_POWER = smd 1 x 1.5: 1 -0.939,-1.384; 2 0.961,-1.384 | smd 2.9 x 2.05: 3 0.011,0.716
R0805W = smd 1.5 x 1: 1 -1.052,0; 2 1.052,0
R0805W' = smd 1.5 x 1: 1 -0.94,0; 2 0.94,0
0204V = drill 0.813 octagon: 1 -1.27,0; 2 1.27,0
TACTILE-SWITCH-SMD = smd 1.524 x 0.762: 1 -2.794,1.905; 2 2.794,1.905; 3 -2.794,-1.905; 4 2.794,-1.905
ROTARY_ENC_PLAIN = drill 1.016: A 7.493,-2.54; B 7.493,2.54; C 7.493,0; SW+ -6.985,2.54; SW- -6.985,-2.54 | drill 2.286: P$3 0,6.604; P$4 0,-6.604
SOT23 = smd 1 x 1.4: 1 -0.95,-1.1; 2 0.95,-1.1; 3 0,1.1
SSOP8 = smd 1.3 x 0.4: P$1 -1.9,0.975; P$2 -1.9,0.325; P$3 -1.9,-0.325; P$4 -1.9,-0.975; P$5 1.9,-0.975; P$6 1.9,-0.325; P$7 1.9,0.325; P$8 1.9,0.975
D2PACK = smd 1.6 x 3.5: 1 -2.54,1.75; 3 2.54,1.75 | smd 12.2 x 9.75: 4 0,12.025
SO-08 = smd 0.7 x 2.2: 1 -1.905,-2.6; 2 -0.635,-2.6; 3 0.635,-2.6; 4 1.905,-2.6; 5 1.905,2.6; 6 0.635,2.6; 7 -0.635,2.6; 8 -1.905,2.6
KEYSTONE_COMBO_18650 = drill 1.2 pad 2.184 octagon: T+ 74.34,10.325; T- 2.7,10.325 | smd 7.6 x 8: T+$1 77.855,10.16; T-$1 -0.805,10.16 | hole 3.45: 11.025,2.32; 66.025,18.325; 74.305,2.32
MICROMATCH8 = drill 0.8 square: P$1 -4.445,-1.27 | drill 0.8: P$2 -3.175,1.27; P$3 -1.905,-1.27; P$4 -0.635,1.27; P$5 0.635,-1.27; P$6 1.905,1.27; P$7 3.175,-1.27; P$8 4.445,1.27
0805W = smd 1.5 x 1: 1 -1.052,0; 2 1.052,0
R_PDSO_G3 = smd 0.635 x 1.27: P$1 0,0; P$2 1.9,0; P$3 0.95,2.7
TSOP36X_SMD = smd 0.9 x 2.54: P$1 -1.905,-2.165; P$2 -0.635,-2.165; P$3 0.635,-2.165; P$4 1.905,-2.165
TP_THT = drill 0.6 pad 0.9: 1 -0.02,0
PAK100/2500-5-12 = drill 1 pad 1.422 square: 1 -6.35,-1.27 | drill 1 pad 1.422: 2 -6.35,1.27; 3 -3.81,-1.27; 4 -3.81,1.27; 5 -1.27,-1.27; 6 -1.27,1.27; 7 1.27,-1.27; 8 1.27,1.27; 9 3.81,-1.27; 10 3.81,1.27; 11 6.35,-1.27; 12 6.35,1.27
PAK100/2500-5-08 = drill 1 pad 1.422 square: 1 -3.81,-1.27 | drill 1 pad 1.422: 2 -3.81,1.27; 3 -1.27,-1.27; 4 -1.27,1.27; 5 1.27,-1.27; 6 1.27,1.27; 7 3.81,-1.27; 8 3.81,1.27
0530480210 = drill 0.6 pad 0.9 long: 1 0,0; 2 1.25,0

### Placement (x,y rotation side)
C1  45,87 0 top
C2  48,82.4 90 top
C3  91.2,33.2 90 top
C4  74.2,44.6 0 top
C5  54.4,54.4 0 top
C6  43.6,72 90 top
C7  45,91.6 0 top
C8  54.4,51.8 0 top
C9  82.6,70.8 180 top
C10  82.6,76.8 180 top
C11  87.4,70.8 0 top
C12  87.4,76.8 0 top
C13  82.6,82.4 180 top
C14  87.4,82.8 0 top
C15  74.2,54.6 0 top
C16  69.8,44.6 180 top
C17  82.2,15.4 180 top
C18  57.4,22.6 180 top
C19  64.8,22.6 180 top
C20  72.6,22.6 180 top
C21  56,63.8 180 top
C22  96.4,84.4 0 top
C23  68.2,34.6 180 top
C25  81.8,54.4 270 top
C70  74,58 180 top
D2  16.6,12.2 90 top
G1  72,18.8 270 bottom
IC1  82.8,35.2 90 top
J1  47.93,39.04 0 top
J2  93.65,39.04 0 top
J3  50.47,39.04 0 top
J4  91.11,39.04 0 top
LED1  33.4,6.4 180 top
LED2  38.4,6.4 180 top
LED3  23.4,6.4 180 top
LED4  28.4,6.4 180 top
LED5  18.4,6.4 180 top
Q1  23.8,96.6 0 top
Q2  45.8,77.6 270 top
Q3  48.2,72.2 90 top
Q5  45,96.6 0 top
Q7  50.8,94.4 180 top
R1  19.2,95.2 180 top
R2  25.8,6.4 270 top
R3  0R_0805  [R0805W']  31.8,23 270 top
R4  86.8,58.6 270 top
R5  46,82.4 270 top
R6  42.2,82.4 90 top
R7  30.8,6.4 270 top
R8  36,6.4 270 top
R9  20.8,6.4 270 top
R10  16,6.4 270 top
R11  40.4,95.2 180 top
R12  66.8,38.4 90 top
R13  64.8,38.4 90 top
R14  91.4,66.6 180 top
R15  90.4,71.6 90 top
R16  92.4,82 270 top
R17  74.6,82.6 0 top
R18  73.6,89 270 top
R19  74.6,80.6 0 top
R20  55,93.2 0 top
R21  50.8,97.8 0 top
R22  19.2,12.2 270 top
R23  74.6,78.6 0 top
R24  21.2,12.2 270 top
R25  44,82.4 270 top
R26  42.2,33 90 top
R27  52,81.4 180 top
R28  52,79.6 0 top
R29  54.4,56.8 0 top
R30  42.4,77.6 90 top
R31  90.4,82 90 top
R32  96.4,89 270 top
R33  42.4,60.4 270 top
R34  51.8,72.2 270 top
R35  48,33 90 top
R36  42.2,27.6 90 top
R37  45,35.8 180 top
R38  72.6,18.6 180 top
R39  64.8,18.6 180 top
R40  57.4,18.6 180 top
R41  57.4,20.6 0 top
R42  64.8,20.6 0 top
R43  72.6,20.6 0 top
R44  54,62 0 top
R45  49,35.8 0 top
S1  9.8,6.2 270 top
SW1  49.2,9.8 0 top
T1  54.4,59.4 90 top
T2  52,76.8 270 top
T3  55,96.4 0 top
T4  45,33 270 top
T5  45,27.6 270 top
U1  85,67.8 0 top
U2  85,73.8 0 top
U3  85,79.8 0 top
U4  66,57 0 top
U$1  72,40.4 90 top
U$2  20.2,16.8 90 top
U$3  41.2,16.8 90 top
U$4  96.4,77.2 270 top
U$5  53.8,88.4 270 top
U$7  19.2,97.8 0 top
U$8  40.4,97.8 0 top
U$13  53.8,22 180 top
U$20  23.2,11 0 top
U$26  87.2,10.6 180 top
U$27  42.8,30.6 0 top
U$28  42.8,25.2 0 top
U$30  72,49.2 90 top
X1  87.6,89 0 top
X2  67.4,89 0 top
X3  50,32.4 90 bottom

### Tracks (layer width: path | path; a pad name or v marks a point on that pad's centre or on a via)
2S  (via drill 0.3)
  Top 0.305: 42.2,74 42.4,74.2 R30.1 42.49,76.64 Q2.2 | Q3.2 49.67,73.25 R34.1 | v37.6,37 37.6,38.8 37.8,39 37.8,59.8 36.8,60.8 36.8,61 36.4,61.4 36.4,77.4 36.2,77.6 36.2,78.4 37.2,79.4 37.2,86.8 | R37.2 42.95,36.8 v42.6,36.8
  Top 0.813: Q1.2 24.76,92.84 v25,92.6 | v25.4,87.8 28,87.8 29,86.8 37.2,86.8 37.6,86.8 39.6,84.8 39.6,76.6 42.2,74 43.4,74 C6.+ 45.4,73.8 46.2,74.6 48.8,74.6 49.58,73.82 Q3.2 49.6,73.18
  Bottom 0.305: v42.6,36.8 37.8,36.8 v37.6,37
  Bottom 0.813: v25,92.6 25,88.2 v25.4,87.8
3V3  (via drill 0.3)
  Top 0.305: U3.P$1 83.55,80.78 | R5.1 46,86.2 C1.+ | 85.6,65.2 85.4,65.2 84.6,66 81.4,66 77.2,70.2 77.2,76.6 76.2,77.6 73.8,77.6 73.55,77.85 R23.1 | 85.6,65.2 91.8,65.2 92.4,65.8 92.4,66.55 R14.1 92.45,67.75 v92.2,68 | v90,70 90,70.55 R15.1 | U$1.8 69.2,38.3 69.2,36.2 69.2,36.15 | 84.2,22.2 84.2,15.4 | 84.2,15.4 84.2,10.6 85,9.8 85.8,9.8 86.56,10.56 U$26.P$3 | C17.1 84.2,15.4 | R4.1 86.8,59.8 v86,60.6 | v86,65.8 86,65.6 85.6,65.2 | R13.1 64.8,36.15 | R12.1 66.8,36.15 | R45.2 50.2,35.8 51,36.6
  Top 0.406: R23.1 R19.1 73.55,81.6 | 73.55,81.6 R17.1 | 84.6,76.8 84.6,82.2 84,82.8 C13.1 83.55,80.78 | 84.6,76.8 84.6,70.8 | 84.6,70.8 84.6,66 | 84.6,76.8 C10.1 83.55,74.78 U2.P$1 | 84.6,70.8 C9.1 83.55,68.78 U1.P$1 | 72.4,86.4 v73.2,86.4 | v73,81.6 73.55,81.6 | 84.2,22.2 82.8,23.6 76.2,23.6 75.4,22.8 75.4,19.4 74.4,18.4 R38.1 73.85,18.05 v72.6,17 | v62,25.2 60,23.2 60,19.2 59.4,18.6 R40.1 58.6,18.45 58.6,17 | v61.8,27.8 61.4,27.8 58.8,30.4 58.8,35.95 59,36.15 | U$13.P$3 52.9,19.3 v55.2,17 | v57.2,17 58.6,17 | 58.6,17 v62.8,17 | v64.4,17 66.2,17 | 66.2,17 v70.8,17 | R39.1 66.2,18.25 66.2,17 | 69.2,36.2 67,36.2 | U$1.2 72.03,39.77 72,39.8 | C3.1 90.97,32.02 IC1.2 85.22,32.02 84.4,31.2 82.4,31.2 79.8,28.6 76.2,28.6 74.6,30.2 69.8,30.2 68.8,31.2 68.8,36.15 | C16.1 72,44.6 C4.1
  Top 0.61: U$5.3 47.56,87.77 | 47.56,87.77 C1.+ 46.8,87.4 v46,88.2 47.13,88.2 47.56,87.77 | R32.2 96.53,87.6 97,87.6 97.8,88.4 97.8,92.4 96.6,93.6 77,93.6 75.8,92.4 75.8,88.8 74.73,87.73 R18.2 73.6,87.6 72.4,86.4 70.2,86.4 69.2,85.4 v63.6,85.4 | v50.6,84.6 51.4,83.8 59.2,83.8 v60.8,85.4 | v38,84 38.2,83.8 v38.2,62.8 38.8,62.2 38.8,38.4 v38.4,38 | v55,36.2 55.05,36.15 59,36.15 64.8,36.15 66.8,36.15 68.8,36.15 69.2,36.15 70.95,36.15 72,37.2 72,39.8 72,44.6 72,46.2 70.91,47.3 U$30.8 | v42.6,38 46.6,38 47.4,37.2 50.4,37.2 51,36.6 v51.4,36.2
  Bottom 0.305: v92.2,68 90.4,69.8 v90,70 | v86,60.6 v86,65.8
  Bottom 0.406: v73.2,86.4 73.4,86.2 73.4,83.8 73,83.4 v73,81.6 | v62,25.2 62,27.6 v61.8,27.8 | v55.2,17 v57.2,17 | v62.8,17 v64.4,17 | v70.8,17 v72.6,17
  Bottom 0.61: v63.6,85.4 v60.8,85.4 | v50.6,84.6 47,88.2 v46,88.2 42,88.2 38,84.2 v38,84 | J1.1 39.1,61.9 v38.2,62.8 | v51.4,36.2 v55,36.2 | v42.6,38 42.2,38 41.8,37.6 38.8,37.6 v38.4,38
!CS_H  (via drill 0.3)
  Top 0.305: 87.92,68.12 v88,68.2 88,68.12 U1.P$7 | v89.6,68.2 89.8,68.4 91.4,68.4 92.4,69.4 92.4,72.8 93.62,74.03 U$4.P$7
  Bottom 0.305: v88,68.2 v89.6,68.2
!RST_H  (via drill 0.3)
  Top 0.305: U2.P$7 88.72,74.12 89.2,74.6 90.4,74.6 v91,75.2 | U$4.P$6 v94.8,75.3
  Bottom 0.305: v94.8,75.3 91.09,75.3 v91,75.2
+5V  (via drill 0.3)
  Top 0.305: U3.P$8 86.45,80.78 | 86.45,74.78 U2.P$8 | R31.2 90.4,84.2 90.2,84.4 | R16.1 92.4,84.4 | v41,57 41,37.4 32.8,29.2 32.8,26.8 v33,26.6 | v30.8,26.6 30.8,23.2 28.2,20.6 26.8,20.6 26.4,20.2 26.4,14.6 25.6,13.8 24.25,13.8 U$20.P$3 | 71.6,56.25 71.6,56.4
  Top 0.406: C14.1 85.8,82.8 85.4,82.4 85.4,76.8 | 85.4,76.8 85.4,71.2 85.8,70.8 C11.1 86.45,68.78 U1.P$8 | 86.45,80.78 C14.1 | 85.4,76.8 C12.1 86.45,74.78 | C14.1 86.45,84.35 86.4,84.4 | C15.1 71.6,56.25
  Top 0.61: 92.55,83.2 R16.1 | 95.13,84.4 92.4,84.4 90.2,84.4 86.4,84.4 v72.4,84.4 | 95.85,84.4 C22.1 95.13,84.4 | U$4.P$1 95.13,84.4 | v72,82.8 72,77.6 72.8,76.8 72.8,61.4 71.8,60.4 71.8,58.4 | 71.6,56.4 71,55.8 62.8,55.8 59,59.6 59,61.2 58.2,62 R44.2 55.25,62.2 v56.4,62.2
  Top 0.813: 68.54,57.54 68.54,58 | 68.54,58 U4.3 | 71.6,58 C70.+ 71.8,58.4 | 71.6,58 68.54,58 | 71.6,56.4 71.6,58
  Bottom 0.305: v41,57 43.1,57 44.2,58.1 48.8,58.1 49.2,58.6 49.2,60.03 49.77,60.65 52.6,60.65 54,62 55.6,62 | v33,26.6 v30.8,26.6 | 55.8,62 56,62.2 v56.4,62.2
  Bottom 0.61: v72,82.8 72,84 v72.4,84.4 | 55.8,62 55.6,62
BSY_H
  Top 0.305: U3.P$6 91.88,79.47 92.4,80 | 92.4,80 R16.2 | 92.4,80 92.8,80.4 95.6,80.4 97.67,78.33 U$4.P$4
CLK_H
  Top 0.305: U$4.P$5 94.97,76.56 91.6,73.2 91.6,69.6 91.2,69.2 89.2,69.2 88.8,68.8 88.8,67.8 88.47,67.47 U1.P$6
GND  (via drill 0.3)
  Top 0.305: C2.2 v48,84.8
  Top 0.406: U1.P$4 82.03,66.83 v81.8,66.8
  Top 0.61: C14.2 88.35,81.85 v88.4,81.6 | C12.2 88.35,77.95 v88.4,78 | U$3.T- 31.8,20.43 R3.2
  other vias: 81.4,81.2 81.8,78.2 80.4,70.8 88.4,69.7 58.6,77.8 84.8,86.6 79.8,82.6 81.8,75.4 88.2,75.4 74.8,86.6 95.2,92 93.4,70.6 94,65.8 93.6,72.2 98,52.6 95.6,37.8 88,28.6 74.6,92.2 77.2,92.2 37.4,95.4 16.4,95.2 19.6,4.2 29.6,4.2 37.2,4.2 2,50 22.2,10 41.4,91.6 42.2,85.2 54.4,90.2 54.4,86.6 58.4,86.6 58.4,90.2 33.2,21 29.8,21 16.4,17.4 24.6,17.4 36.2,85.4 23.4,85.6 13.2,76.2 8,76 7.6,21.6 13.6,25.2 59.8,75.4 55,80.8 50.6,74.6 50.8,82.8 53.6,63.8 57,60.4 57,54.4 57,51.8 66,62.2 28.4,25 36.8,53.2 76.4,42.4 83.8,58 59.4,56 54.8,47.8 80,34.6 70,22.6 62.4,22.6 55,22.8 60.2,31 58.4,39.4 51.4,34.6 55.8,34.2 39.6,20 42,1.6 5.8,5.8 83.8,1.6 89,15.8 98.2,28 98,98.2 59.6,98.2 98.8,87 68.4,75.4 67.6,82 81.8,72.2 67.4,44.6 40.2,33.2 76.6,44.6 76.2,51.2 72,51 80.2,58 59.8,51.6 57.2,95.4 44.8,30.8 44.8,25.4 36.4,89.4 13.2,5.8
  pour Top (isolate 0.406): 0,100 100,100 100,0 0,0
  pour Bottom (isolate 0.406): 0,100 100,100 100,0 0,0
GND5  (via drill 0.3)
  Top 0.406: C22.2 98,84.2 | C15.2 75.8,55.25 C70.-
  Top 0.61: v96.6,81.2 98,82.6 98,84.2 98,85.2 97.4,85.8 94.2,85.8 93.8,85.4 v70.6,85.4 | v70.6,83.2 70.6,70.83 U4.4 67.21,69.12 68.22,69.2
  Top 0.813: R3.1 31.8,29.6 40,37.8 40,64.4 44,68.4 | 44,68.4 44.4,68.8 52.4,68.8 v52.6,69 | C6.- 43.6,68.8 44,68.4 | 68.22,69.2 70.8,66.62 v70.8,63 | v74.2,62.6 75.8,61 C70.- | v58.8,69 67.09,69 67.21,69.12
  Bottom 0.61: U$4.P$3 96.4,80.38 96.4,81 v96.6,81.2 | v70.6,85.4 v70.6,83.2
  Bottom 0.813: v52.6,69 v58.8,69 | v70.8,63 71.2,62.6 v74.2,62.6
MOSI_H  (via drill 0.3)
  Top 0.305: U2.P$6 89.08,73.47 89.6,74 91,74 94.8,77.8 95.8,77.8 v96.4,78.4
  Bottom 0.305: v96.4,78.4 97.67,79.67 U$4.P$2
N$1  (via drill 0.3)
  Top 0.813: Q3.3 47.48,70.52 v47.8,70.2 | 58.4,64 58.4,67.2 v58.8,67.6 | 58.4,64 60.2,62.2 60.2,60.2 61.8,58.6 63.31,58.6 U4.1 | C21.1 58.2,63.8 58.4,64
  Bottom 0.813: v47.8,70.2 49.6,70.2 52.2,67.6 v58.8,67.6
N$2
  Top 0.305: R1.1 22.86,95.2 Q1.1
N$3
  Top 0.305: X3.2 48.4,33.65 R35.2 | 47.8,34.05 R35.2 | R37.1 R45.1 48,35.75 R35.2
N$4
  Top 0.305: U1.P$5 90.12,66.83 R14.2
N$5
  Top 0.305: R2.2 26.75,5.35 27.2,5.8 27.2,7 27.6,7.4 28.35,7.4 LED4.A
N$6
  Top 0.305: Q7.2 49.75,95.78 R21.1 | S1.4 S1.3 7.89,10.49 8.6,11.2 14,11.2 14.6,11.8 14.6,20.6 11,24.2 11,76.8 24,89.8 29.2,89.8 30.2,88.8 32.2,88.8 33.6,90.2 35,90.2 35.2,90.4 35.4,90.4 35.6,90.6 35.6,93.2 36.4,94 42,94 42.4,93.6 45.4,93.6 45.96,94.16 Q5.2
  Top 0.813: Q5.2 47.62,95.22 48.2,95.8 49.82,95.8 Q7.2
N$7
  Top 0.305: R9.2 21.75,5.35 22.2,5.8 22.2,7 22.6,7.4 23.35,7.4 LED3.A
N$8
  Top 0.305: R7.2 31.75,5.35 32.2,5.8 32.2,7 32.6,7.4 33.35,7.4 LED1.A
N$9
  Top 0.305: R6.1 R25.2 44,80.4 44.4,80 47,80 48,81 C2.1
  Top 0.406: C2.1 49.05,81.45 49.6,82 49.6,86.2 49.8,86.4 51.1,86.4 U$5.4
N$10
  Top 0.813: U$7.2 23.81,97.8 Q1.3
N$11
  Top 0.813: U$8.2 45.01,97.8 Q5.3
N$12
  Top 0.305: R8.2 36.75,5.35 37.2,5.8 37.2,7 37.6,7.4 38.35,7.4 LED2.A
N$13
  Top 0.305: R9.1 22.35,9 24.6,9 25.2,9.6 25.2,10.9 U$20.P$2
N$14
  Top 0.305: R10.2 16.75,5.35 17.2,5.8 17.2,7 17.6,7.4 18.35,7.4 LED5.A
N$15
  Top 0.305: R10.1 14.85,7.45 14.4,7 14.4,4 15.2,3.2 39,3.2 39.8,4 39.8,8.8 38.4,10.2 38.4,20.8 39,21.4 49.8,21.4 50.6,22.2 51.7,22.2 U$13.P$2
N$16
  Top 0.305: T4.1 42.1,33.95 R26.2
N$17
  Top 0.305: U2.P$5 87.68,72.83 87.85,72.65 R15.2
N$20
  Top 0.305: U3.P$7 89.58,80.12 R31.1
N$21
  Top 0.305: X3.1 48.05,32.4 R35.1 46.95,31.95 | 46.95,31.95 T4.3 | T5.3 46.1,31.09 46.95,31.95
N$22
  Top 0.305: R26.1 42.2,31.18 U$27.1
N$23
  Top 0.305: D2.C 15.4,15.55 15.4,20.8 11.8,24.4 11.8,76.6 24.2,89 28.8,89 29.8,88 33.4,88 33.6,88.2 41,88.2 42,89.2 45.8,89.2 46.8,90.2 C7.+
  Top 0.61: U$5.2 50.79,89.03 50.79,89.45 | U$5.1 50.79,90.31 50.79,90.2
  Top 0.813: Q7.3 50.79,91.6 | 50.79,91.6 50.79,90.2 50.79,89.45 | C7.+ 50.79,91.6
N$24
  Top 0.305: R11.1 44.06,95.2 Q5.1
N$25
  Top 0.61: R18.1 X2.8 X2.7
N$26
  Top 0.305: R25.1 44.55,83.45 45,83 45,81.8 45.4,81.4 45.95,81.4 R5.2
N$27
  Top 0.61: C23.1 G1.+ 73.8,32.4 76.6,29.6 79.4,29.6 80.4,30.6 80.4,32.7 79.8,33.3 IC1.14
N$28
  Top 0.305: SW1.SW+ 52.74,12.34 56.35,15.95 R40.2 R41.1
N$29
  Top 0.305: Q2.3 46.8,77.31 46.8,77.8 48.6,79.6 R28.1
N$30  (via drill 0.3)
  Top 0.305: Q2.1 42.51,78.54 R30.2 42.4,79 v41.8,79.6 | T1.3 52.3,60.65 47.2,60.65 47,60.4 v46.85,60.4 | v37.8,61 37.2,61.8 37.2,77.8 v37,78
  Bottom 0.305: v37,78 38.6,79.6 v41.8,79.6 | v37.8,61 38.4,60.4 v46.85,60.4
N$31
  Top 0.305: T3.1 53.95,95.3 R20.1
N$32
  Top 0.305: 55.9,56.85 R29.2 55.5,56.85 T1.1
N$33
  Top 0.305: R42.1 R39.2 63.6,18.45 63.6,16.6 63.2,16.2 57.6,16.2 56.69,15.29 SW1.B
N$34
  Top 0.305: 71.8,18.35 R38.2 | 71.75,20.2 R43.1 R38.2 | R38.2 arc-90 71.75,18.4 71.75,16.75 71.2,16.2 64.4,16.2 63.6,15.4 58.8,15.4 58,14.6 58,8.57 SW1.A
N$35  (via drill 0.3)
  Top 0.305: R33.1 42.4,64.2 45.6,67.4 v45.4,67.6 | v48.8,75.6 48.8,77 49.4,77.6 50.75,77.6 T2.1
  Bottom 0.305: v45.4,67.6 46.8,69 46.8,71.6 48.8,73.6 v48.8,75.6
N$36
  Top 0.305: T5.1 42.3,28.55 R36.2
N$37
  Top 0.305: Q3.1 49.7,71.15 R34.2 52.55,71.15 53.2,71.8 53.2,76.7 T2.3
N$38
  Top 0.61: X1.11 X1.12 R32.1
N$39
  Top 0.305: U$28.1 42.2,25.78 R36.1
N$40  (via drill 0.3)
  Top 0.305: v76.8,49.8 74.64,49.8 U$30.3 | v78.8,49.8 79.4,49.8 82,52.4 C25.+
  Bottom 0.305: v76.8,49.8 v78.8,49.8
N$41
  Top 0.61: J3.21 50.57,62 R44.1
N_BAT1
  Top 0.813: U$8.1 30.88,97.8 U$3.T+ 23.74,91.14 9.88,77.28 U$2.T-
N_BAT2
  Top 0.813: U$2.T+ 16.54,97.8 U$7.1
P1.2_A2_J1.2  (via drill 0.3)
  Top 0.305: v42.4,58 R33.2
  Bottom 0.305: J1.2 43.76,59.36 v42.4,58
P1.3_A3_J1.6  (via drill 0.3)
  Top 0.305: J1.6 46.6,49.2 46.2,49.6 46.2,63.8 47.8,65.4 54,65.4 56.8,68.2 56.8,77.6 59,79.8 60.6,79.8 60.8,79.6 v61,79.6 | R20.2 60.6,93.2 61.6,92.2 61.6,83.2 61.4,83 v61.2,83
  Bottom 0.305: v61.2,83 61.2,79.8 v61,79.6
P1.4_A4_J3.27  (via drill 0.3)
  Top 0.305: R7.1 30.8,9.4 31.6,10.2 35,10.2 36.8,12 36.8,21.4 38.4,23 49.2,23 53.2,27 53.2,46.6 v53.4,46.6
  Bottom 0.305: v53.4,46.6 53.14,46.66 J3.27
P1.5_A5_J3.28  (via drill 0.3)
  Top 0.305: R8.1 36,10.2 37.6,11.8 37.6,21.2 38.6,22.2 49.4,22.2 54,26.8 54,44 v54.2,44.2
  Bottom 0.305: v54.2,44.2 50.55,44.2 J3.28
P2.5_IO_J4.34  (via drill 0.3)
  Top 0.305: v87.6,46 87,46.6 77,46.6 76.6,46.2 73.2,46.2 70.83,48.56 U$30.7
  Bottom 0.305: J4.34 90.65,46.2 88.2,46.2 88,46 v87.6,46
P2.6_CAPTURE_J4.35  (via drill 0.3)
  Top 0.305: v87.6,47.8 87,47.2 74.69,47.2 U$30.1
  Bottom 0.305: v87.6,47.8 89,49.2 J4.35
P3.0_A12_J3.23
  Top 0.305: J3.23 50.49,56.8 R29.1
P3.1_A13_J3.24  (via drill 0.3)
  Top 0.305: R22.2 19.75,11.15 20.2,11.6 20.2,12.25 R24.1 21.2,14.6 22,15.4 24.8,15.4 25.6,16.2 25.6,20.4 26.6,21.4 27.8,21.4 30,23.6 30,25.8 29.8,26 29.8,27 v30.4,27.6 | v42.6,55.4 41.8,54.6 41.8,37.2 33.6,29 33.6,27.6 v33.8,27.4 | J3.24 50.59,54.4 C5.1
  Bottom 0.305: J3.24 50.47,54.33 49.2,55.55 42.8,55.55 v42.6,55.4 | v33.8,27.4 33.6,27.6 v30.4,27.6
P3.2_A14_J3.25  (via drill 0.3)
  Top 0.305: J3.25 50.53,51.8 C8.1 53.6,51.65 53.6,50.6 54,50.2 57.6,50.2 58.2,50.8 v58.2,57 | R27.1 R28.2 53.05,78.55 v53.4,78.2 | v57.6,76.8 57.6,65.6 v57.4,65.4
  Bottom 0.305: v53.4,78.2 56.2,78.2 v57.6,76.8 | v57.4,65.4 58.6,64.2 58.6,60.6 58.2,60.2 v58.2,57
P3.3_A15_J3.26
  Top 0.305: R2.1 25.8,7.8 29,11 34.8,11 36,12.2 36,21.6 38.2,23.8 49,23.8 52.4,27.2 52.4,48.8 52,49.2 J3.26
P4.4_IO_J2.18  (via drill 0.3)
  Top 0.254: 90,58.1 92.27,58.1
  Top 0.305: U3.P$3 80.47,79.47 79.8,78.8 79.8,76.2 80.6,75.4 v80.6,75.2 | v74.6,73.6 74.8,73.4 74.8,69.4 80.6,63.6 83,63.6 83.8,62.8 88.6,62.8 89.4,62 89.4,58.8 90,58.1 | 92.27,58.1 J2.18
  Bottom 0.305: v80.6,75.2 80.6,75 80,74.4 79.8,74.4 79.2,73.8 75.8,73.8 75.6,73.6 v74.6,73.6
P5.0_SPIMOSI_J2.15  (via drill 0.3)
  Top 0.305: R17.2 78.6,82.4 | 78.6,82.4 79.2,81.8 79.2,75.6 v79.6,75.2 81.33,73.47 U2.P$3 | 78.6,82.4 78.4,82.2 v78.4,82 | v75.2,74.4 75.4,74.2 75.4,69.6 80.8,64.2 83.4,64.2 84.2,63.4 94.8,63.4 95.4,62.8 95.4,49.8 94.8,49.2 J2.15 | v85.2,48.8 85,48.8 84.6,48.4 78.4,48.4 77.8,49 77.8,50.8 76.2,52.4 70.2,52.4 69.2,51.4 U$30.5
  Bottom 0.254: 92.45,47.94 89.2,47.94
  Bottom 0.305: v78.4,82 78.4,85.8 79,86.4 82.4,86.4 83.73,87.73 X1.3 | v79.6,75.2 78.8,74.4 v75.2,74.4 | J2.15 92.45,47.94 | 89.2,47.94 88.26,47 86.8,47 85.2,48.6 v85.2,48.8
P5.1_SPIMISO_J2.14  (via drill 0.3)
  Top 0.305: X1.5 86.33,87.87 85.2,89 79.6,89 77.6,87 77.4,87 v77.2,86.8 | v76.4,76.2 76.6,76 76.6,70 81.2,65.4 84.2,65.4 85,64.6 95.6,64.6 96.6,63.6 96.6,55.4 97,55 97,54.2 96.2,53.4 96.2,49 93.86,46.66 J2.14 | v88.8,45.4 88.6,45.6 88.6,48.2 88.2,48.6 86.6,48.6 85.8,47.8 77,47.8 76.2,48.6 74.64,48.6 U$30.2
  Bottom 0.254: 92.39,45.4 v88.8,45.4
  Bottom 0.305: v77.2,86.8 76.8,86.4 76.8,76.6 v76.4,76.2 | J2.14 92.39,45.4
P5.2_SPICLK_J1.7  (via drill 0.3)
  Top 0.305: 77.6,83.6 84.6,83.6 v85,83.2 | 77.6,78 v77.6,78.4 | v77.6,83.4 77.6,83.6 | v77.6,78.4 77.6,77.8 77.8,77.6 77.8,70.4 80.6,67.6 82.2,67.6 82.33,67.47 U1.P$3 | 77.6,83.6 71.4,83.6 70.8,84.2 64.2,84.2 63.4,83.4 63.4,81.6 62.4,80.6 58.8,80.6 56,77.8 56,68.6 53.6,66.2 47.6,66.2 45.4,64 45.4,47.2 45.94,46.66 J1.7 | v53.4,47.95 54.8,49.4 57.8,49.4 58.23,49.84 U$30.6 | R23.2 77.4,78.6 v77.6,78.4
  Bottom 0.254: J1.7 49.27,47.95 v53.4,47.95
  Bottom 0.305: X1.7 88.87,86.67 88.4,86.2 86,86.2 85,85.2 v85,83.2 | v77.6,78.4 v77.6,83.4
P5.3_IO_J2.17  (via drill 0.3)
  Top 0.305: v75.6,76.8 75.6,75.2 76,74.8 76,69.8 81,64.8 83.8,64.8 84.6,64 95.2,64 96,63.2 96,54.8 v96.2,54.6
  Bottom 0.305: X1.1 76.73,87.73 76,87 76,77.2 v75.6,76.8 | v96.2,54.6 95.88,54.28 J2.17
P5.7_PWM_J2.19  (via drill 0.3)
  Top 0.305: v96,36.8 96.2,37 96.2,31 91.4,26.2 61.8,26.2 58.35,22.75 C18.1 58.35,20.9 R41.2 | v97,40.4 97,53 97.8,53.8 97.8,55.2 97.4,55.6 97.4,58.8 97.6,59 v97.6,59.2
  Bottom 0.305: v97.6,59.2 97.44,59.36 J2.19 | v97,40.4 97,37.8 v96,36.8
P6.3_IO_J1.8  (via drill 0.3)
  Top 0.305: v55,42.85 55,42.2 56.8,40.4 v56.8,38.8 | v57.8,35.2 57.8,30.2 61,27 84.2,27 v84.4,27.2 | v84.6,23.8 85.3,23.11 U$26.P$4
  Bottom 0.254: 49.25,42.85 v55,42.85
  Bottom 0.305: J1.8 49.25,42.85 | v56.8,38.8 57.8,37.8 v57.8,35.2 | v84.4,27.2 84.6,27 v84.6,23.8
P7.0_I2CSDA_J1.10  (via drill 0.3)
  Top 0.305: J1.10 44.76,39.04 43.8,40 43.8,64.4 47.2,67.8 52.8,67.8 54.4,69.4 54.4,78.2 58.2,82 61.4,82 62.2,82.8 62.2,90.8 63,91.6 65.4,91.6 66,91 66,90.4 X2.4 X2.3 | 69.31,42.4 U$1.5 | v55.2,37.6 55.8,37 62.4,37 63,37.6 63,38.8 63.65,39.45 R13.2 65,40 67.31,42.3 U$1.5 | U$1.5 70.69,42.3 v71,42 | v75,37 76.4,35.6 76.4,32.6 76.97,32.02 IC1.15
  Bottom 0.305: J1.10 49.37,37.6 v55.2,37.6 | v71,42 75,38 v75,37
P7.1_I2CSCL_J1.9  (via drill 0.3)
  Top 0.305: J1.9 46.02,41.58 44.6,43 44.6,64.2 47.4,67 53.2,67 55.2,69 55.2,78 58.5,81.3 62,81.3 62.8,82.1 62.8,86.94 X2.1 X2.2 | v55.2,40.3 56,39.5 56,38 56.2,37.8 61.8,37.8 62.2,38.2 62.2,39 64.2,41 v64.6,41 | R12.2 66.8,39.85 67.37,40.43 | 67.37,40.43 67.98,41.03 U$1.6 69.44,41 v70.8,41 | v67,40.8 67.37,40.43 | v74,37.2 74,36.8 74.8,36 75,36 75.6,35.4 75.6,32 76.8,30.8 78.16,30.8 IC1.16
  Bottom 0.254: 49.11,40.3 v55.2,40.3
  Bottom 0.305: J1.9 49.11,40.3 | v64.6,41 64.8,40.8 v67,40.8 | v70.8,41 74,37.8 v74,37.2
P7.3_CAPTURE_J4.36  (via drill 0.3)
  Top 0.305: U2.P$2 81.88,74.12 v81.8,74.2 | v74,72.8 74.2,72.6 74.2,69.2 80.4,63 82.6,63 83.4,62.2 88.2,62.2 88.8,61.6 88.8,52.6 | 88.8,52.6 89.66,51.74 J4.36 | 88.8,52.6 v89.2,52.6 | R4.2 86.8,56.6 87.4,56 v87.4,52.6
  Bottom 0.305: v81.8,74.2 80.8,74.2 80.2,73.6 80,73.6 79.6,73.2 76,73.2 75.6,72.8 v74,72.8 | v89.2,52.6 v87.4,52.6
P8.1_IO_J2.11
  Top 0.305: J2.11 95.36,39.04 97,37.4 97,30.6 91.8,25.4 71,25.4 68.2,22.6 C19.1 65.85,22.5 R42.2
P8.2_IO_J2.12
  Top 0.305: R43.2 73.65,22.5 C20.1 75.55,24.6 92.2,24.6 97.8,30.2 97.8,38.2 94.42,41.58 J2.12
P8.3_IO_J2.13  (via drill 0.3)
  Top 0.254: 90,45.4 92.6,45.4
  Top 0.305: R19.2 77.6,80.6 78.4,79.8 78.4,70.6 79.2,69.8 | U1.P$2 80.88,68.12 79.2,69.8 | 79.2,69.8 v79.2,70.4 | v75.6,66.6 76,66.6 80.2,62.4 82.2,62.4 83,61.6 87.6,61.6 88.2,61 88.2,52.2 89.4,51 89.4,46 90,45.4 | 92.6,45.4 93.65,44.35 J2.13
  Bottom 0.305: v79.2,70.4 75.6,66.8 v75.6,66.6
PUSH
  Top 0.305: S1.2 S1.1 15.54,8.99 D2.A 17.25,10.05 18,10.8 18,13 18.2,13.2 19.15,13.2 R22.1
WAKE_INT  (via drill 0.3)
  Top 0.305: Q7.1 51.85,95.78 R21.2 55,97.8 T3.3 55.1,97.6 57.6,97.6 58.8,96.4 58.8,95 60,93.8 61,93.8 62.4,92.4 66.6,92.4 67.4,91.6 v67.4,86.6 | IC1.3 89.09,33.3 89.6,33.8 89.6,44.2 89.2,44.6 88.4,44.6 87.8,45.2 87.2,45.2 86.4,46 84,46 v83.8,45.8 | v84,49.2 84.4,49.2 84.8,49.6 85.6,49.6 86,49.2 88,49.2 88.6,49.8 88.6,50.8 87.6,51.8 87,51.8 86.6,52.2 86.6,55.8 85.6,56.8 85.6,59.8 84.4,61 82.6,61 81.8,61.8 79.8,61.8 75.8,65.8 75.2,65.8 74.8,66.2 74.8,67.6 v74,68.4 | v67.4,83.2 67.6,83.4 68.4,83.4 69.6,82.2 69.6,76.8 v69.4,76.6
  Bottom 0.305: v83.8,45.8 83.8,49 v84,49.2 | v74,68.4 69.4,73 v69.4,76.6 | v67.4,83.2 v67.4,86.6

### Text on the board
Top: 1
Bottom: 2
bDocu: P3.7 | P1.2 | P3.6 | P5.7 | P6.1 | P3.5 | P3.0 | P4.4 | P6.0 | P3.4 | P3.1 | P5.3 | P6.2 | P7.3 | P3.2 | !RST | P1.3 | P2.6 | P3.3 | P5.0 | P5.2 | P2.5 | P1.4 | P5.1 | P6.3 | P4.3 | P1.5 | P8.3 | P7.1 | P4.2 | P4.7 | P8.2 | P7.0 | P4.1 | P8.0 | P8.1
tmine: Noritake / VFD | On/Off | 3V3_OK | 5V_OK | sig2 | sig3 | sig4
bmine: PMOD - I2C | PMOD - SPI | 2S | 1S | 1 7.1 SCL / 2 7.1 SCL / 3 7.0 SDA / 4 7.0 SDA / 5 GND / 6 GND / 7 3v3 / 8 3v3 | 1 5.3 CS / 2 / 3 5.0 MOSI / 4 / 5 5.1 MISO / 6 / 7 5.2 SCLK / 8 / 9 GND / 10 GND / 11 3v3 / 12 3v3 | GND | Petre Rodan 202202 display board rev 1.0